# Altium project radxa_cm5_io_board_v2200_SCH-1.PrjPcb (part 1 of 5)
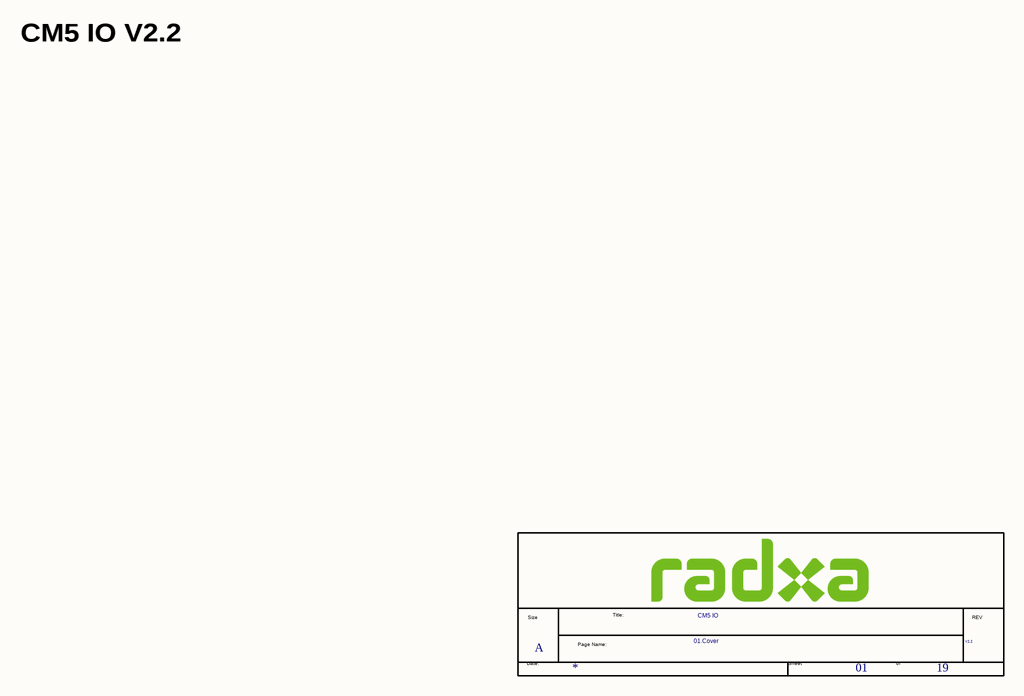
[diagram p0: 01_COVER.SchDoc]
19 sheets, 502 parts. Net scope: global (net labels, ports and power ports of the same name join across sheets).
Sheets:
  01_COVER.SchDoc
  02_INDEX.SchDoc
  03_Block.SchDoc
  04_HDMII_TX.SchDoc
  05_Ethernet.SchDoc
  06_MicroSD_Card.SchDoc
  07_PCIE_WIFI.SchDoc
  08_AUDIO.SchDoc
  09_MIPI_LCD_TX1.SchDoc
  10_MIPI_LCD_TX2.SchDoc
  11_MIPI_CAM_RX.SchDoc
  12_USB_HUB.SchDoc
  13_USB30_USB20.SchDoc
  14_FAN_RTC.SchDoc
  15_Power_DCIN.SchDoc
  16_40PIN_Connector.SchDoc
  17_Connector.SchDoc
  18_Type_C.SchDoc
  19_KEY_LED.SchDoc

## Sheet 01_COVER.SchDoc
size 297 x 209 mm

### Parts
(Parts that share a designator on the sheet are numbered #1, #2 ... from top to bottom, then left to right.)
*#1  Doc: 01.Cover  RevCode: V2.2  Title: CM5 IO  Page Size: A  Page Number: 01  Page Count: 19  (hidden comment: radxa_1010)  (graphical)

### Notes on the sheet
- CM5 IO V2.2
- (in symbol radxa_1010) Size; Title:; REV; Page Name:; Date:; Sheet; of

### Library data of the parts
*#1 = radxa_1010: Page Create Date: March  8, 1995; Page Modify Date: *

## Sheet 02_INDEX.SchDoc
size 297 x 209 mm
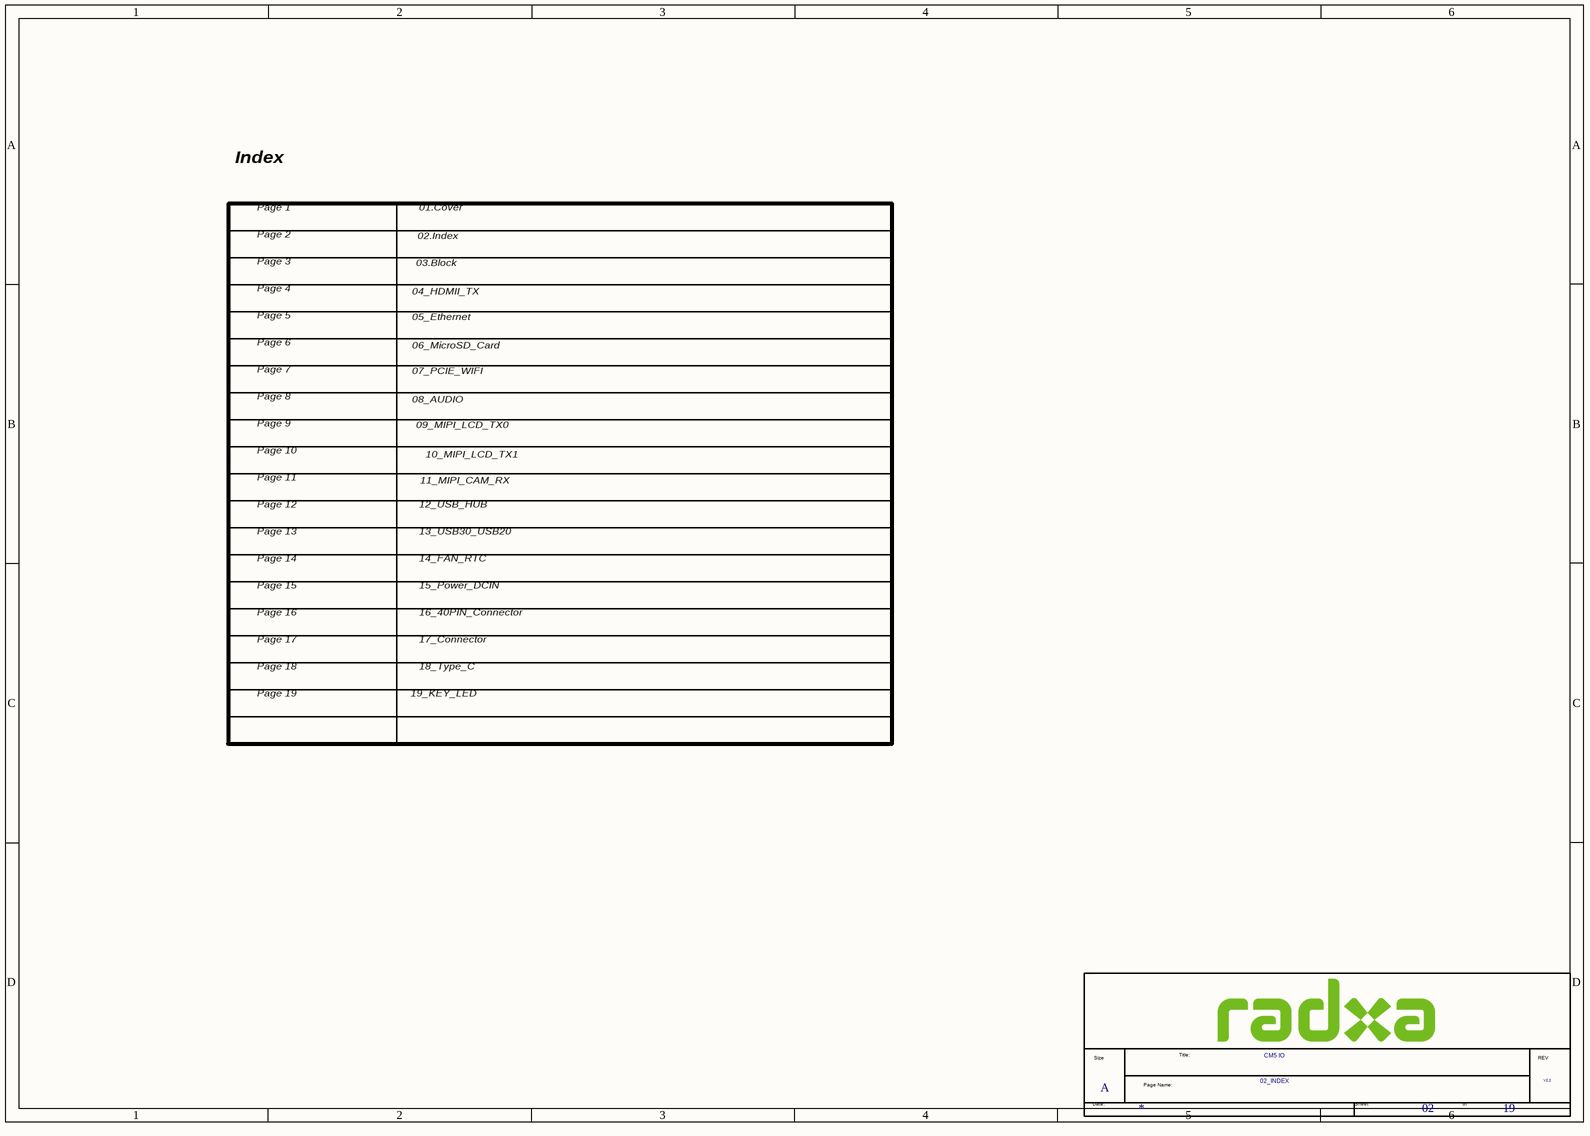
[diagram p1: 02_INDEX.SchDoc]

### Parts
(Parts that share a designator on the sheet are numbered #1, #2 ... from top to bottom, then left to right.)
*#2  Doc: 02_INDEX  RevCode: V2.2  Title: CM5 IO  Page Size: A  Page Number: 02  Page Count: 19  (hidden comment: radxa_1010)  (graphical)

### Notes on the sheet
- Index
- Page 1
- Page 3
- Page 2
- 03.Block
- 02.Index
- 01.Cover
- Page 5
- Page 4
- 05_Ethernet
- 04_HDMII_TX
- Page 8
- Page 6
- Page 7
- 06_MicroSD_Card
- 07_PCIE_WIFI
- 08_AUDIO
- Page 9
- Page 10
- 09_MIPI_LCD_TX0
- 10_MIPI_LCD_TX1
- Page 12
- Page 13
- Page 11
- 12_USB_HUB
- 13_USB30_USB20
- 11_MIPI_CAM_RX
- Page 14
- Page 15
- 15_Power_DCIN
- 14_FAN_RTC
- Page 18
- Page 16
- Page 17
- 16_40PIN_Connector
- 17_Connector
- 18_Type_C
- Page 19
- 19_KEY_LED
- (in symbol radxa_1010) Size; Title:; REV; Page Name:; Date:; Sheet; of

### Library data of the parts
*#2 = radxa_1010: Page Create Date: March  8, 1995; Page Modify Date: *

## Sheet 03_Block.SchDoc
size 459 x 350 mm
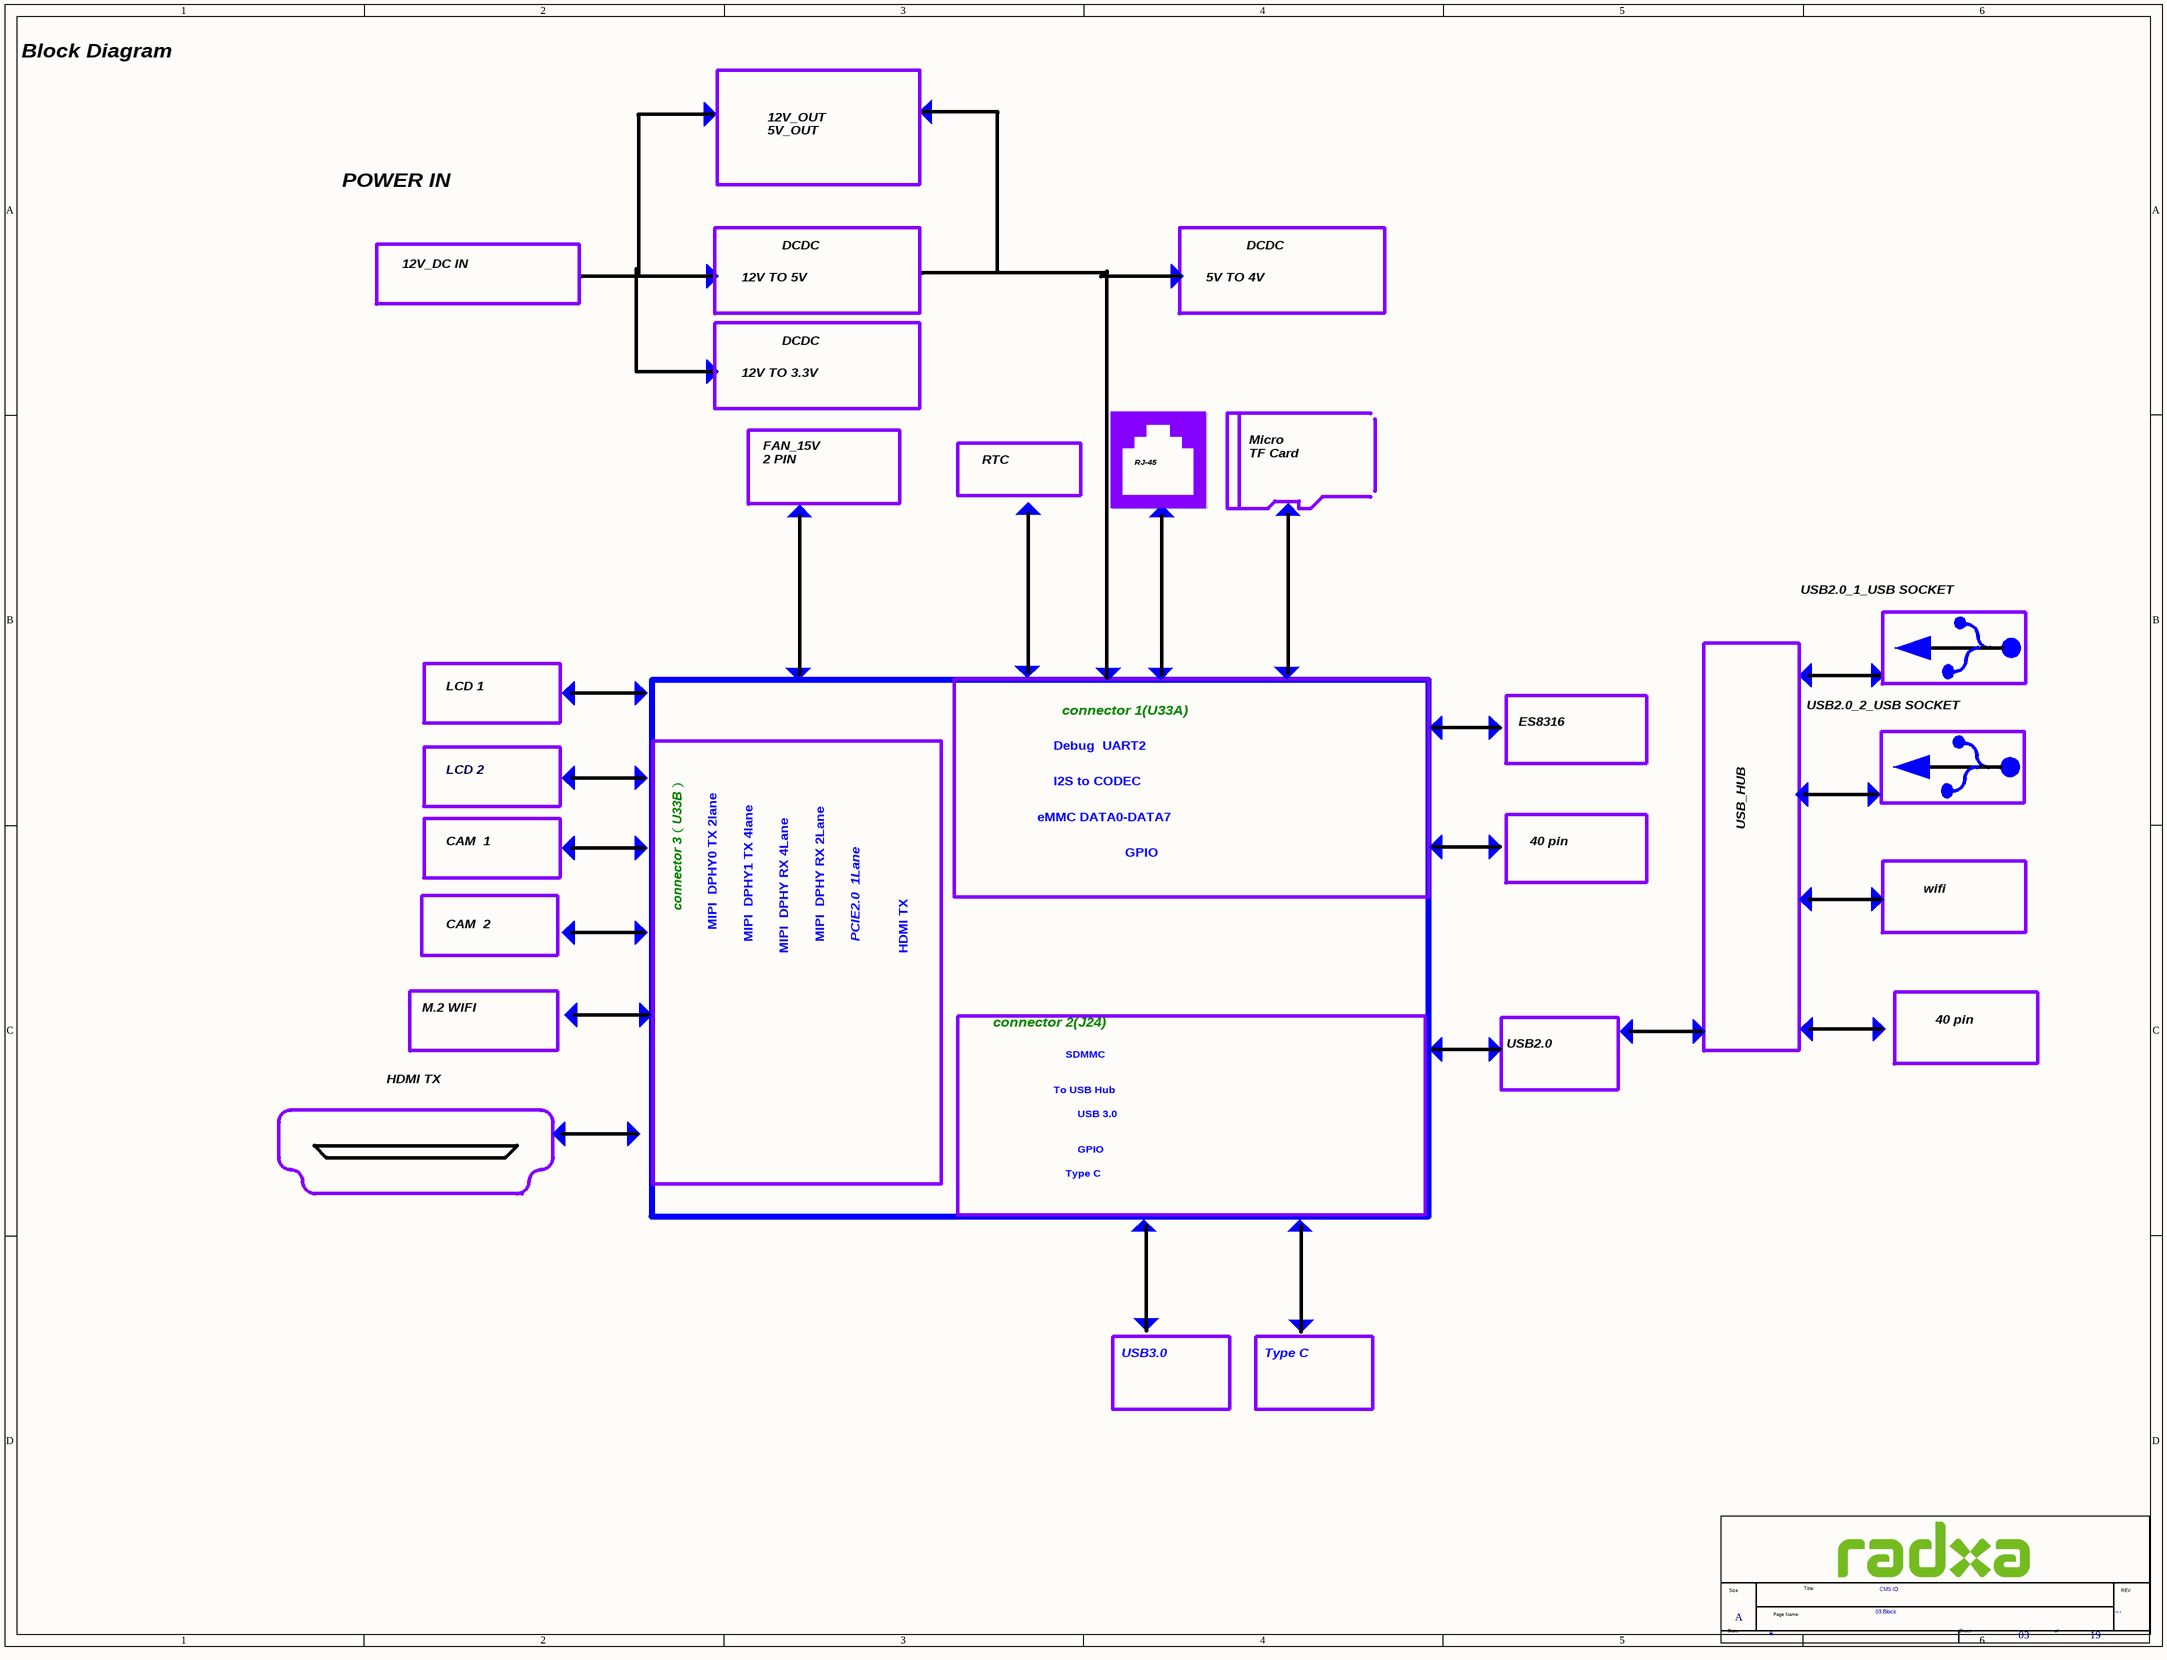
[diagram p2: 03_Block.SchDoc]

### Parts
(Parts that share a designator on the sheet are numbered #1, #2 ... from top to bottom, then left to right.)
*#3  Doc: 03.Block  RevCode: V2.2  Title: CM5 IO  Page Size: A  Page Number: 03  Page Count: 19  (hidden comment: radxa_1010)  (graphical)

### Notes on the sheet
- Block Diagram
- 12V_OUT
  5V_OUT
- POWER IN
- 12V_DC IN
- 12V TO 5V
- DCDC
- 5V TO 4V
- 12V TO 3.3V
- FAN_15V
  2 PIN
- RTC
- RJ-45
- Micro
  TF Card
- USB2.0_1_USB SOCKET
- LCD 1
- connector 1(U33A)
- USB2.0_2_USB SOCKET
- LCD 2
- Debug  UART2
- ES8316
- eMMC DATA0-DATA7
- I2S to CODEC
- USB_HUB
- CAM  1
- GPIO
- 40 pin
- wifi
- CAM  2
- connector 3（U33B）
- MIPI  DPHY0 TX 2lane
- MIPI  DPHY1 TX 4lane
- MIPI  DPHY RX 4Lane
- MIPI  DPHY RX 2Lane
- PCIE2.0  1Lane
- HDMI TX
- M.2 WIFI
- connector 2(J24)
- SDMMC
- USB2.0
- To USB Hub
- USB 3.0
- Type C
- USB3.0
- (in symbol radxa_1010) Size; Title:; REV; Page Name:; Date:; Sheet; of

### Library data of the parts
*#3 = radxa_1010: Page Create Date: March  8, 1995; Page Modify Date: *

## Sheet 04_HDMII_TX.SchDoc
size 297 x 209 mm
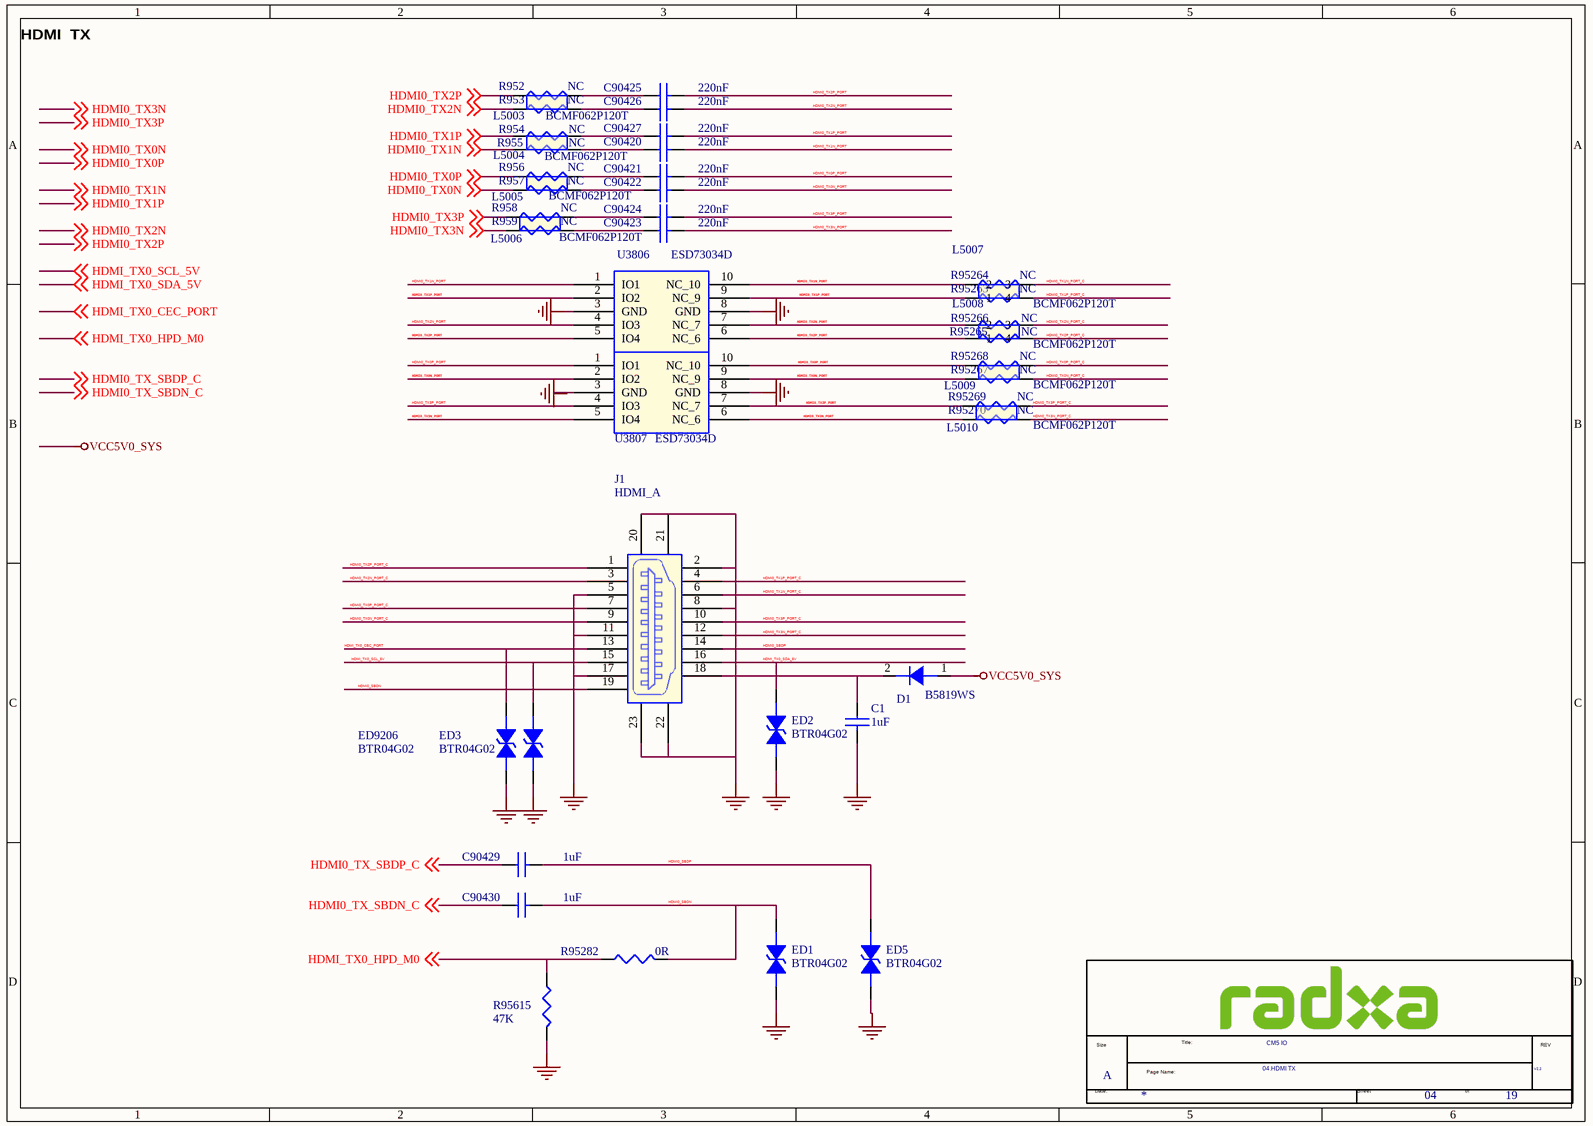
[diagram p3: 04_HDMII_TX.SchDoc]

### Parts
(Parts that share a designator on the sheet are numbered #1, #2 ... from top to bottom, then left to right.)
*#4  Doc: 04.HDMI TX  RevCode: V2.2  Title: CM5 IO  Page Size: A  Page Number: 04  Page Count: 19  (hidden comment: radxa_1010)  (graphical)
C1  1uF  [C0402]
C90420  220nF  [C0201]
C90421  220nF  [C0201]
C90422  220nF  [C0201]
C90423  220nF  [C0201]
C90424  220nF  [C0201]
C90425  220nF  [C0201]
C90426  220nF  [C0201]
C90427  220nF  [C0201]
C90429  1uF  [C0201]
C90430  1uF  [C0201]
D1  B5819WS  [SOD_323]
ED1  BTR04G02  [ESD0402_1xD5]
ED2  BTR04G02  [ESD0402_1xD5]
ED3  BTR04G02  [ESD0402_1xD5]
ED5  BTR04G02  [ESD0402_1xD5]
ED9206  BTR04G02  [ESD0402_1xD5]
J1  HDMI_A  [HDMIA19S]
L5003  BCMF062P120T  [MCZ1210AH900L2]
L5004  BCMF062P120T  [MCZ1210AH900L2]
L5005  BCMF062P120T  [MCZ1210AH900L2]
L5006  BCMF062P120T  [MCZ1210AH900L2]
L5007  BCMF062P120T  [MCZ1210AH900L2]
L5008  BCMF062P120T  [MCZ1210AH900L2]
L5009  BCMF062P120T  [MCZ1210AH900L2]
L5010  BCMF062P120T  [MCZ1210AH900L2]
R952  NC  [R0402]
R953  NC  [R0402]
R954  NC  [R0402]
R955  NC  [R0402]
R956  NC  [R0402]
R957  NC  [R0402]
R958  NC  [R0402]
R959  NC  [R0402]
R95263  NC  [R0402]
R95264  NC  [R0402]
R95265  NC  [R0402]
R95266  NC  [R0402]
R95267  NC  [R0402]
R95268  NC  [R0402]
R95269  NC  [R0402]
R95270  NC  [R0402]
R95282  0R  [R0402]
R95615  47K  [R0402]
U3806  ESD73034D  [SON10_2R50X1R00X0R50]
U3807  ESD73034D  [SON10_2R50X1R00X0R50]

### Nets
GND: C1.2 ED1.2 ED2.2 ED3.2 ED5.2 ED9206.2 J1.2 J1.5 J1.8 J1.11 J1.17 J1.20 J1.21 J1.22 J1.23 R95615.2 U3806.3(GND) U3806.8(GND) U3807.8(GND)
VCC5V0_SYS: D1.1(A)
HDMI0_SBDN: C90430.2 ED1.1 J1.19 R95282.2
HDMI0_SBDP: C90429.2 ED5.1 J1.14
HDMI0_TX0N: L5005.2 R957.1 ; off-sheet HDMI0_TX0N
HDMI0_TX0N_PORT: C90422.2 L5009.2 R95267.1 U3807.2(IO2) U3807.9(NC_9)
HDMI0_TX0N_PORT_C: J1.9 L5009.3 R95267.2
HDMI0_TX0P: L5005.1 R956.1 ; off-sheet HDMI0_TX0P
HDMI0_TX0P_PORT: C90421.2 L5009.1 R95268.1 U3807.1(IO1) U3807.10(NC_10)
HDMI0_TX0P_PORT_C: J1.7 L5009.4 R95268.2
HDMI0_TX1N: L5004.2 R955.1 ; off-sheet HDMI0_TX1N
HDMI0_TX1N_PORT: C90420.2 L5007.2 R95264.1 U3806.1(IO1) U3806.10(NC_10)
HDMI0_TX1N_PORT_C: J1.6 L5007.3 R95264.2
HDMI0_TX1P: L5004.1 R954.1 ; off-sheet HDMI0_TX1P
HDMI0_TX1P_PORT: C90427.2 L5007.1 R95263.1 U3806.2(IO2) U3806.9(NC_9)
HDMI0_TX1P_PORT_C: J1.4 L5007.4 R95263.2
HDMI0_TX2N: L5003.2 R953.1 ; off-sheet HDMI0_TX2N
HDMI0_TX2N_PORT: C90426.2 L5008.2 R95266.1 U3806.4(IO3) U3806.7(NC_7)
HDMI0_TX2N_PORT_C: J1.3 L5008.3 R95266.2
HDMI0_TX2P: L5003.1 R952.1 ; off-sheet HDMI0_TX2P
HDMI0_TX2P_PORT: C90425.2 L5008.1 R95265.1 U3806.5(IO4) U3806.6(NC_6)
HDMI0_TX2P_PORT_C: J1.1($PIN0) L5008.4 R95265.2
HDMI0_TX3N: L5006.2 R959.1 ; off-sheet HDMI0_TX3N
HDMI0_TX3N_PORT: C90423.2 L5010.2 R95270.1 U3807.5(IO4) U3807.6(NC_6)
HDMI0_TX3N_PORT_C: J1.12 L5010.3 R95270.2
HDMI0_TX3P: L5006.1 R958.1 ; off-sheet HDMI0_TX3P
HDMI0_TX3P_PORT: C90424.2 L5010.1 R95269.1 U3807.4(IO3) U3807.7(NC_7)
HDMI0_TX3P_PORT_C: J1.10 L5010.4 R95269.2
HDMI0_TX_SBDN_C: C90430.1 ; off-sheet HDMI0_TX_SBDN_C
HDMI0_TX_SBDP_C: C90429.1 ; off-sheet HDMI0_TX_SBDP_C
HDMI_TX0_CEC_PORT: ED9206.1 J1.13 ; off-sheet HDMI_TX0_CEC_PORT
HDMI_TX0_HPD_M0: R95282.1 R95615.1 ; off-sheet HDMI_TX0_HPD_M0
HDMI_TX0_SCL_5V: ED3.1 J1.15 ; off-sheet HDMI_TX0_SCL_5V
HDMI_TX0_SDA_5V: ED2.1 J1.16 ; off-sheet HDMI_TX0_SDA_5V
NetC1_1: C1.1 D1.2(K) J1.18
NetC90420_1: C90420.1 L5004.3 R955.2
NetC90421_1: C90421.1 L5005.4 R956.2
NetC90422_1: C90422.1 L5005.3 R957.2
NetC90423_1: C90423.1 L5006.3 R959.2
NetC90424_1: C90424.1 L5006.4 R958.2
NetC90425_1: C90425.1 L5003.4 R952.2
NetC90426_1: C90426.1 L5003.3 R953.2
NetC90427_1: C90427.1 L5004.4 R954.2

Not connected (* = marked no-connect by the designer): U3807 3(GND)

### Notes on the sheet
- HDMI  TX
- Labels drawn without touching a wire or pin: GND
- (in symbol radxa_1010) Size; Title:; REV; Page Name:; Date:; Sheet; of

### Library data of the parts
C1 = CAP NP_0: cap,1.00uF,+/-10%,10V,X5R,C0402; Manufacturer: TDK; RK PN: C1005X5R1A105K050BB; Priority: A; Tolerance: 10%; Voltage: 10V; PCB Footprint: C0402; Dielectric: X5R; Part Type: C0402; Manufacturer PN: C1005X5R1A105K050BB; Created by: JJJ
C90420-C90424 C90427 = CAP NP_0_Dup5: cap,220.00nF,+/-10%,10V,X5R,C0201; Manufacturer: TDK; RK PN: C0603X5R1A224K030BB; Priority: A; Tolerance: 10%; Voltage: 10V; PCB Footprint: C0201; Dielectric: X5R; Part Type: C0201; Manufacturer PN: C0603X5R1A224K030BB; Created by: JJJ
C90425 C90426 = CAP NP_0_Dup5: cap,220.00nF,+/-10%,10V,X5R,C0201; Manufacturer PN: C0603X5R1A224K030BB; Manufacturer: TDK; Tolerance: 10%; Priority: A; Voltage: 10V; PCB Footprint: C0201; Dielectric: X5R; Created by: JJJ; Part Type: C0201; RK PN: C0603X5R1A224K030BB
C90429 C90430 = CAP NP_0_Dup5: cap,1.00uF,+/-10%,10V,X5R,C0402; Manufacturer PN: C1005X5R1A105K050BB; Manufacturer: TDK; Tolerance: 10%; Priority: A; Voltage: 10V; PCB Footprint: C0201; Dielectric: X5R; Created by: JJJ; Part Type: C0402; RK PN: C1005X5R1A105K050BB
D1 = DIODE_Dup1: Schottky Barrier，B5819WS SOD-323; Manufacturer: 长电; Priority: A; PCB Footprint: SOD_323; Created by: JJJ; Manufacturer PN: B5819WS; Part Type: Schottky rectifier; RK PN: B5819WS
ED1 ED2 = DIODE BI_DIR TRIG_2: 1-Line, Bi-directional, Transient Voltage Suppressors.17.5pF.; Manufacturer PN: ESD5451N; Manufacturer: WillSemi(韦尔半导体); Priority: A; PCB Footprint: ESD0402_1xD5; Created by: JJJ; Part Type: ESD_TVS; RK PN: ESD5451N
ED3 ED5 ED9206 = DIODE BI_DIR TRIG_2: 1-Line, Bi-directional, Transient Voltage Suppressors.17.5pF.; Manufacturer: WillSemi(韦尔半导体); RK PN: ESD5451N; Priority: A; PCB Footprint: ESD0402_1xD5; Part Type: ESD_TVS; Manufacturer PN: ESD5451N; Created by: JJJ
J1 = HDMI_A: 通用A型HDMI座,卧式,侧插; Manufacturer: 旺科达; Priority: A; PCB Footprint: HDMIA19S; Created by: JJJ; Manufacturer Part Number: HDMI_A; Part Type: HDMI Jack; RK PN: HDMI_A
L5003-L5006 L5009 L5010 = MCZ1210AH900L2_2: PCB Footprint: SMD_TCM0605T
L5007 = MCZ1210AH900L2_0: PCB Footprint: SMD_TCM0605T
L5008 = MCZ1210AH900L2_1: PCB Footprint: SMD_TCM0605T
R952-R959 R95264 = RESISTOR_1_Dup1: 通用厚膜电阻,1K2,+/-5%,R0402,1/16W.; Manufacturer PN: RC0402JR-071K2L; Manufacturer: YAGEO; PCB Footprint: r0201; Tolerance: 5%; Wattage: 1/16W; Priority: A; Created by: YTL; Part Type: 通用厚膜电阻; RK PN: RC0402JR-071K2L
R95263 R95265-R95270 = RESISTOR_1_Dup1: 通用厚膜电阻,1K2,+/-5%,R0402,1/16W.; Manufacturer: YAGEO; PCB Footprint: r0201; Tolerance: 5%; RK PN: RC0402JR-071K2L; Priority: A; Wattage: 1/16W; Part Type: 通用厚膜电阻; Manufacturer PN: RC0402JR-071K2L; Created by: YTL
R95282 = RESISTOR_0_Dup2: 通用厚膜电阻,1K2,+/-5%,R0402,1/16W.; Manufacturer: YAGEO; Tolerance: 5%; RK PN: RC0402JR-071K2L; Priority: A; Wattage: 1/16W; PCB Footprint: R0402; Part Type: 通用厚膜电阻; Manufacturer PN: RC0402JR-071K2L; Created by: YTL
R95615 = RESISTOR_0_Dup4: 通用厚膜电阻,2K49,+/-1%,R0402,1/16W.; Manufacturer PN: RC0402FR-072K49L; Manufacturer: YAGEO; Tolerance: 1%; Wattage: 1/16W; Priority: A; PCB Footprint: R0402; Created by: YTL; Part Type: 通用厚膜电阻; RK PN: RC0402FR-072K49L
U3806 U3807 = ESD_ESD73034D: 4-Lines, Bi-directional, Ultra-low Capacitance Transient Voltage Suppressors; Manufacturer: WillSemi(韦尔半导体); Priority: A; PCB Footprint: SON10_2R50X1R00X0R50; RK PN: ESD73034D; Part Type: ESD_TVS; Manufacturer PN: ESD73034D; Created by: YWQ
*#4 = radxa_1010: Page Create Date: March  8, 1995; Page Modify Date: *

## Sheet 05_Ethernet.SchDoc
size 297 x 209 mm
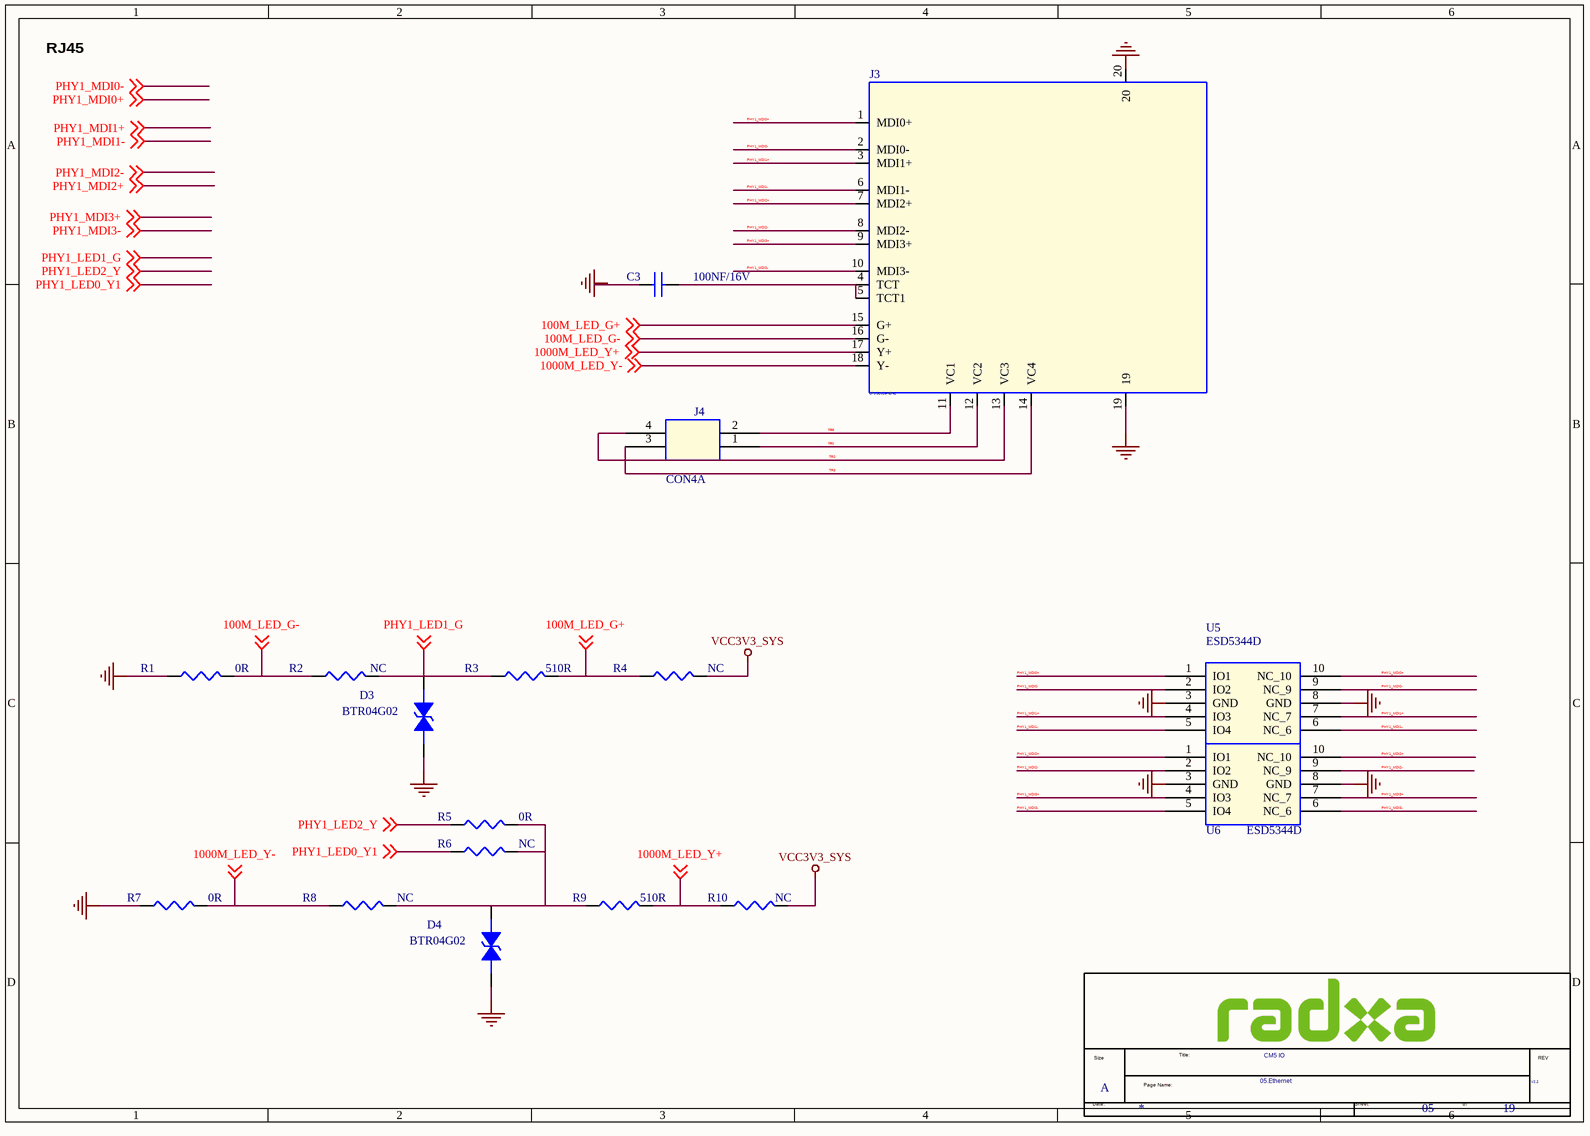
[diagram p4: 05_Ethernet.SchDoc]

### Parts
(Parts that share a designator on the sheet are numbered #1, #2 ... from top to bottom, then left to right.)
*#5  Doc: 05.Ethernet  RevCode: V2.2  Title: CM5 IO  Page Size: A  Page Number: 05  Page Count: 19  (hidden comment: radxa_1010)  (graphical)
C3  100NF/16V  [C0402]
D3  BTR04G02  [ESD0402_1xD5]
D4  BTR04G02  [ESD0402_1xD5]
J3  LPJG0926HENL  [RJ45_PULSE]
J4  CON4A  [DIP4PIN-2_54MM-2X2]
R1  0R  [R0402]
R2  NC  [R0402]
R3  510R  [R0402]
R4  NC  [R0402]
R5  0R  [R0402]
R6  NC  [R0402]
R7  0R  [R0402]
R8  NC  [R0402]
R9  510R  [R0402]
R10  NC  [R0402]
U5  ESD5344D  [SON10_2R50X1R00X0R50]
U6  ESD5344D  [SON10_2R50X1R00X0R50]

### Nets
GND: D3.1 D4.1 J3.19 J3.20 R1.1 R7.1 U5.3(GND) U5.8(GND) U6.3(GND) U6.8(GND)
VCC3V3_SYS: R4.2 R10.2
100M_LED_G+: J3.15(G+) R3.2 R4.1 ; off-sheet 100M_LED_G+
100M_LED_G-: J3.16(G-) R1.2 R2.1 ; off-sheet 100M_LED_G-
1000M_LED_Y+: J3.17(Y+) R9.2 R10.1 ; off-sheet 1000M_LED_Y+
1000M_LED_Y-: J3.18(Y-) R7.2 R8.1 ; off-sheet 1000M_LED_Y-
PHY1_LED0_Y1: R6.1 ; off-sheet PHY1_LED0_Y1
PHY1_LED1_G: D3.2 R2.2 R3.1 ; off-sheet PHY1_LED1_G
PHY1_LED2_Y: R5.1 ; off-sheet PHY1_LED2_Y
PHY1_MDI0+: J3.1(MDI0+) U5.1(IO1) U5.10(NC_10) ; off-sheet PHY1_MDI0+
PHY1_MDI0-: J3.2(MDI0-) U5.2(IO2) U5.9(NC_9) ; off-sheet PHY1_MDI0-
PHY1_MDI1+: J3.3(MDI1+) U5.4(IO3) U5.7(NC_7) ; off-sheet PHY1_MDI1+
PHY1_MDI1-: J3.6(MDI1-) U5.5(IO4) U5.6(NC_6) ; off-sheet PHY1_MDI1-
PHY1_MDI2+: J3.7(MDI2+) U6.1(IO1) U6.10(NC_10) ; off-sheet PHY1_MDI2+
PHY1_MDI2-: J3.8(MDI2-) U6.2(IO2) U6.9(NC_9) ; off-sheet PHY1_MDI2-
PHY1_MDI3+: J3.9(MDI3+) U6.4(IO3) U6.7(NC_7) ; off-sheet PHY1_MDI3+
PHY1_MDI3-: J3.10(MDI3-) U6.5(IO4) U6.6(NC_6) ; off-sheet PHY1_MDI3-
TR0: J3.11(VC1) J4.2
TR1: J3.12(VC2) J4.1
TR2: J3.13(VC3) J4.4
TR3: J3.14(VC4) J4.3
NetC3_2: C3.2 J3.4(TCT) J3.5(TCT1)
NetD4_2: D4.2 R5.2 R6.2 R8.2 R9.1

Not connected (* = marked no-connect by the designer): C3 1

### Notes on the sheet
- RJ45
- Labels drawn without touching a wire or pin: GND
- (in symbol radxa_1010) Size; Title:; REV; Page Name:; Date:; Sheet; of

### Library data of the parts
C3 = CAP NP_0: cap,100.00nF,+/-10%,16V,X5R,C0402; Manufacturer: TDK; RK PN: C1005X5R1C104K050BA; Priority: A; Tolerance: 10%; Voltage: 16V; PCB Footprint: C0402; Dielectric: X5R; Part Type: C0402; Manufacturer PN: C1005X5R1C104K050BA; Created by: JJJ
D3 = DIODE BI_DIR TRIG_2: 1-Line, Bi-directional, Transient Voltage Suppressors.17.5pF.; Manufacturer PN: ESD5451N; Manufacturer: WillSemi(韦尔半导体); OPTION: DNP; Priority: A; PCB Footprint: ESD0402_1xD5; Created by: JJJ; Part Type: ESD_TVS; RK PN: ESD5451N
D4 = DIODE BI_DIR TRIG_2: 1-Line, Bi-directional, Transient Voltage Suppressors.17.5pF.; Manufacturer: WillSemi(韦尔半导体); RK PN: ESD5451N; Priority: A; OPTION: DNP; PCB Footprint: ESD0402_1xD5; Part Type: ESD_TVS; Manufacturer PN: ESD5451N; Created by: JJJ
J3 = HR911130C_1: 千兆网口接口，内置变压器; VAL: J00-0061; DESIG: 10/100 base TX LXT971A; BOI: RJ45; FAB: PULSE; DEV: CON_PULSE_J00-61; Priority: A; PCB Footprint: RJ45_HRK1; REF: J00-0061; Created by: JJJ; Manufacturer Part Number: HR911130C; Part Type: Ethernet Jack; RK PN: HR911130C
J4 = CON4A_0: PCB Footprint: DIP4PIN-2_54MM-2X2
R1 R2 R6 = RESISTOR_0_Dup3: 通用厚膜电阻,0R,+/-5%,R0402,1/16W.; Manufacturer PN: RC0402JR-070RL; Manufacturer: YAGEO; Tolerance: 5%; Wattage: 1/16W; Priority: A; PCB Footprint: R0402; Created by: YTL; Part Type: 通用厚膜电阻; RK PN: RC0402JR-070RL
R3 R9 = RESISTOR_0_Dup3: 通用厚膜电阻,0R,+/-5%,R0402,1/16W.; Manufacturer: YAGEO; Tolerance: 5%; RK PN: RC0402JR-070RL; Priority: A; Wattage: 1/16W; option: DNP; PCB Footprint: R0402; Part Type: 通用厚膜电阻; Manufacturer PN: RC0402JR-070RL; Created by: YTL
R4 = RESISTOR_0_Dup3: 通用厚膜电阻,510R,+/-5%,R0402,1/16W.; Manufacturer PN: RC0402JR-07510RL; Manufacturer: YAGEO; Tolerance: 5%; Wattage: 1/16W; Priority: A; PCB Footprint: R0402; Created by: YTL; Part Type: 通用厚膜电阻; RK PN: RC0402JR-07510RL
R5 R7 R8 = RESISTOR_0_Dup3: 通用厚膜电阻,0R,+/-5%,R0402,1/16W.; Manufacturer: YAGEO; Tolerance: 5%; RK PN: RC0402JR-070RL; Priority: A; Wattage: 1/16W; PCB Footprint: R0402; Part Type: 通用厚膜电阻; Manufacturer PN: RC0402JR-070RL; Created by: YTL
R10 = RESISTOR_0_Dup3: 通用厚膜电阻,510R,+/-5%,R0402,1/16W.; Manufacturer: YAGEO; Tolerance: 5%; RK PN: RC0402JR-07510RL; Priority: A; Wattage: 1/16W; PCB Footprint: R0402; Part Type: 通用厚膜电阻; Manufacturer PN: RC0402JR-07510RL; Created by: YTL
U5 U6 = ESD_ESD5304D: 4-Lines, Uni-directional, Ultra-low Capacitance Transient Voltage Suppressors; Manufacturer: WillSemi(韦尔半导体); Priority: A; PCB Footprint: SON10_2R50X1R00X0R50; Created by: JJJ; Manufacturer PN: ESD5304D; Part Type: ESD_TVS; RK PN: ESD5304D
*#5 = radxa_1010: Page Create Date: March  8, 1995; Page Modify Date: *

## Sheet 06_MicroSD_Card.SchDoc
size 297 x 209 mm
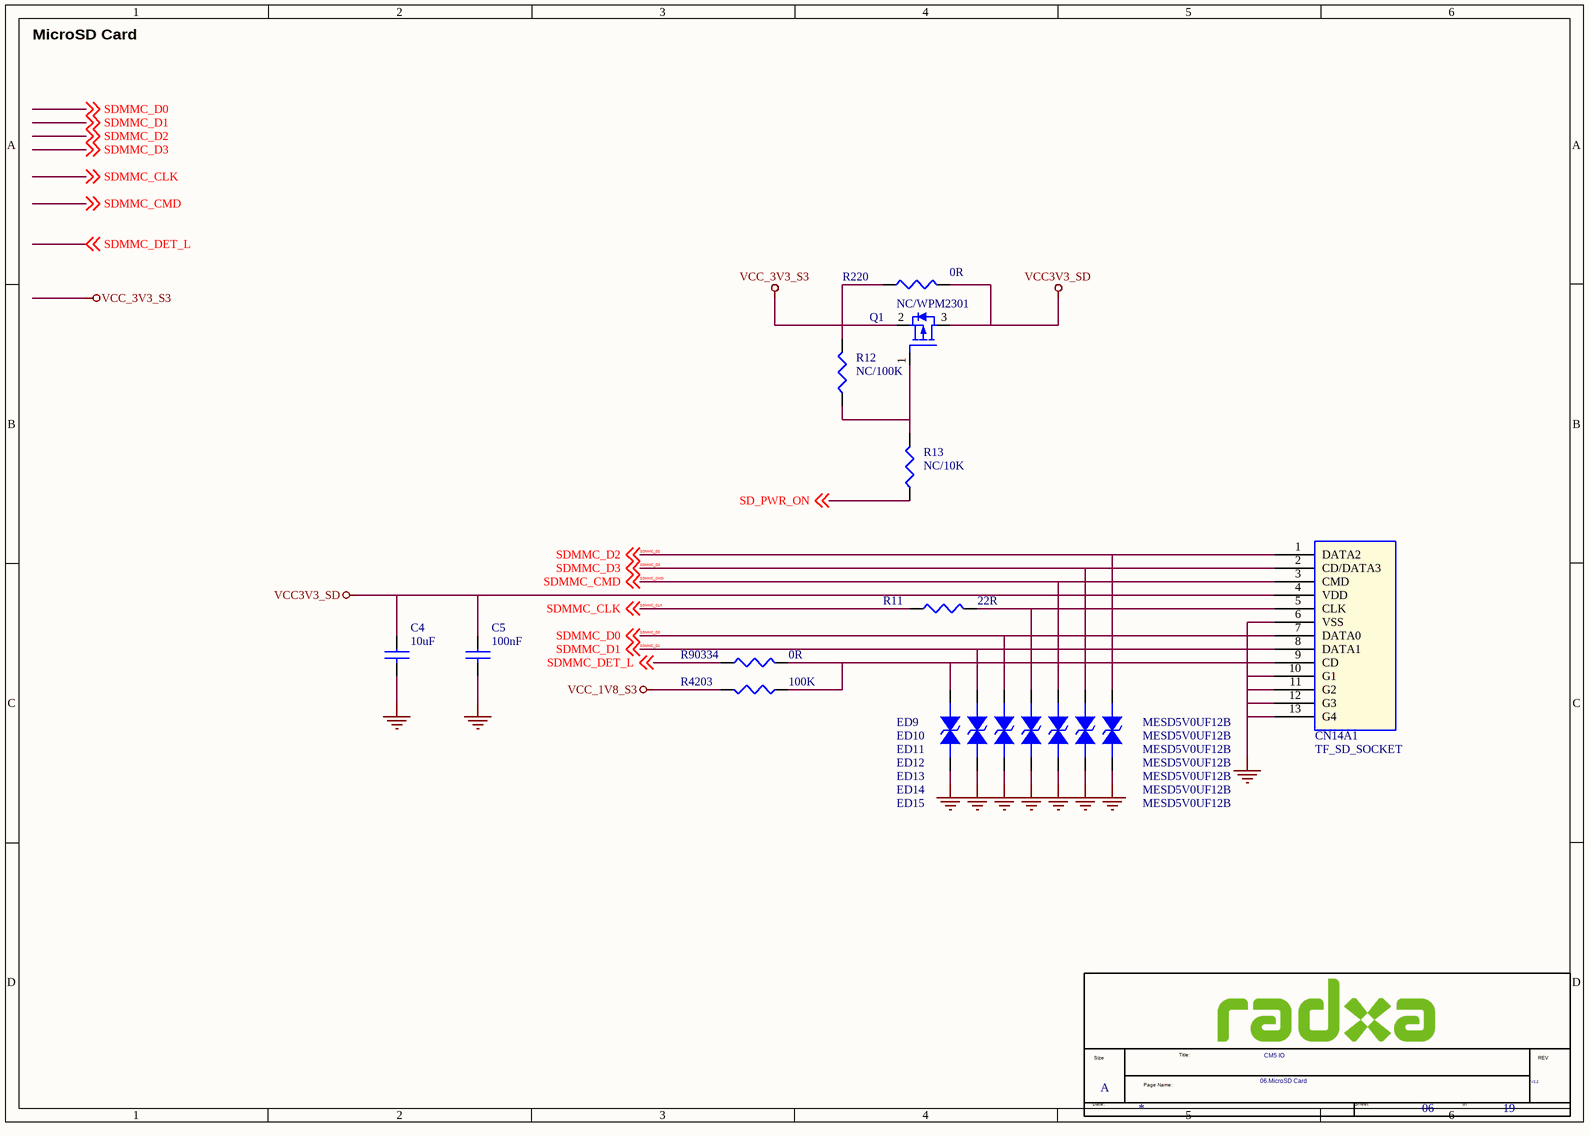
[diagram p5: 06_MicroSD_Card.SchDoc]

### Parts
(Parts that share a designator on the sheet are numbered #1, #2 ... from top to bottom, then left to right.)
*#6  Doc: 06.MicroSD Card  RevCode: V2.2  Title: CM5 IO  Page Size: A  Page Number: 06  Page Count: 19  (hidden comment: radxa_1010)  (graphical)
C4  10uF  [C0603]
C5  100nF  [C0402]
CN14A1  TF_SD_SOCKET  [TF-CKT01-009D]
ED9  MESD5V0UF12B  [E0402N]
ED10  MESD5V0UF12B  [E0402N]
ED11  MESD5V0UF12B  [E0402N]
ED12  MESD5V0UF12B  [E0402N]
ED13  MESD5V0UF12B  [E0402N]
ED14  MESD5V0UF12B  [E0402N]
ED15  MESD5V0UF12B  [E0402N]
Q1  NC/WPM2301  [SOT23]
R11  22R  [R0402]
R12  NC/100K  [R0402]
R13  NC/10K  [R0402]
R220  0R  [R0402]
R4203  100K  [R0402]
R90334  0R  [R0402]

### Nets
GND: C4.2 C5.2 CN14A1.6(VSS) CN14A1.10(G1) CN14A1.11(G2) CN14A1.12(G3) CN14A1.13(G4) ED9.2 ED10.2 ED11.2 ED12.2 ED13.2 ED14.2 ED15.2
VCC3V3_SD: C4.1 C5.1 CN14A1.4(VDD) Q1.3(DRAIN) R220.2
VCC_1V8_S3: R4203.2
VCC_3V3_S3: Q1.2(SOURCE) R12.1 R220.1
SD_PWR_ON: R13.2 ; off-sheet SD_PWR_ON
SDMMC_CLK: R11.1 ; off-sheet SDMMC_CLK
SDMMC_CMD: CN14A1.3(CMD) ED13.1 ; off-sheet SDMMC_CMD
SDMMC_D0: CN14A1.7(DATA0) ED11.1 ; off-sheet SDMMC_D0
SDMMC_D1: CN14A1.8(DATA1) ED10.1 ; off-sheet SDMMC_D1
SDMMC_D2: CN14A1.1(DATA2) ED15.1 ; off-sheet SDMMC_D2
SDMMC_D3: CN14A1.2(CD/DATA3) ED14.1 ; off-sheet SDMMC_D3
SDMMC_DET_L: R90334.1 ; off-sheet SDMMC_DET_L
NetCN14A1_5: CN14A1.5(CLK) ED12.1 R11.2
NetCN14A1_9: CN14A1.9(CD) ED9.1 R4203.1 R90334.2
NetQ1_1: Q1.1(GATE) R12.2 R13.1

### Notes on the sheet
- MicroSD Card
- (in symbol radxa_1010) Size; Title:; REV; Page Name:; Date:; Sheet; of

### Library data of the parts
C4 = CAP NP_0: cap,10.00uF,+/-10%,10V,X5R,C0603; Manufacturer PN: C1608X5R1A106K080AC; Manufacturer: TDK; Tolerance: 10%; C_Voltage: 6.3V; Priority: A; Voltage: 10V; PCB Footprint: C0603; Dielectric: X5R; Created by: JJJ; Part Type: C0603; RK PN: C1608X5R1A106K080AC
C5 = CAP NP_0: cap,100.00nF,+/-10%,10V,X5R,C0402; Manufacturer PN: C1005X5R1A104K050BA; Manufacturer: TDK; C_Voltage: 6.3V; Tolerance: 10%; Priority: A; Voltage: 10V; PCB Footprint: C0402; Dielectric: X5R; Created by: JJJ; Part Type: C0402; RK PN: C1005X5R1A104K050BA
CN14A1 = SD_SOCKET_0: PCB Footprint: TF-CKT01-009D
ED9-ED15 = DIODE BI-DIR TRIG: ESD; PCB Footprint: E0402N
Q1 = MOSFET P: PMOS,WPM3407-3/TR,SOT_23,Id=4.4A,Vds=30V; Manufacturer: WillSemi(韦尔半导体); Pd: 0.9W; Vgsth: 2.0V; VDS: 30V; Vgs: ±20V; Id_max: 4.4A; Priority: A; PCB Footprint: SOT23; Created by: JJJ; Manufacturer PN: WPM3407-3/TR; Part Type: PMOS; RK PN: WPM3407-3/TR
R11 = RESISTOR_1_Dup2: PCB Footprint: R0402
R12 = RESISTOR_0_Dup3: 通用厚膜电阻,100K,+/-5%,R0402,1/16W.; Manufacturer: YAGEO; Tolerance: 5%; RK PN: RC0402JR-07100KL; Priority: A; Wattage: 1/16W; PCB Footprint: R0402; Part Type: 通用厚膜电阻; Manufacturer PN: RC0402JR-07100KL; Created by: YTL
R13 = RESISTOR_0_Dup3: 通用厚膜电阻,10K,+/-5%,R0402,1/16W.; Manufacturer PN: RC0402JR-0710KL; Manufacturer: YAGEO; Tolerance: 5%; Wattage: 1/16W; Priority: A; PCB Footprint: R0402; Created by: YTL; Part Type: 通用厚膜电阻; RK PN: RC0402JR-0710KL
R220 = RESISTOR_0_Dup3: 通用厚膜电阻,0R,+/-5%,R0402,1/16W.; Manufacturer: YAGEO; Tolerance: 5%; PCB Footprint: R0603; RK PN: RC0402JR-070RL; Priority: A; Wattage: 1/16W; Part Type: 通用厚膜电阻; Manufacturer PN: RC0402JR-070RL; Created by: YTL
R4203 = RESISTOR_1: 通用厚膜电阻,100K,+/-5%,R0402,1/16W.; Manufacturer PN: RC0402JR-07100KL; Manufacturer: YAGEO; Tolerance: 5%; Wattage: 1/16W; Priority: A; PCB Footprint: R0402; Created by: YTL; Part Type: 通用厚膜电阻; RK PN: RC0402JR-07100KL
R90334 = RESISTOR_0_Dup2: 通用厚膜电阻,0R,+/-5%,R0402,1/16W.; Manufacturer PN: RC0402JR-070RL; Manufacturer: YAGEO; Tolerance: 5%; Wattage: 1/16W; Priority: A; PCB Footprint: R0402; Created by: YTL; Part Type: 通用厚膜电阻; RK PN: RC0402JR-070RL
*#6 = radxa_1010: Page Create Date: March  8, 1995; Page Modify Date: *

## Sheet 07_PCIE_WIFI.SchDoc
size 386 x 246 mm
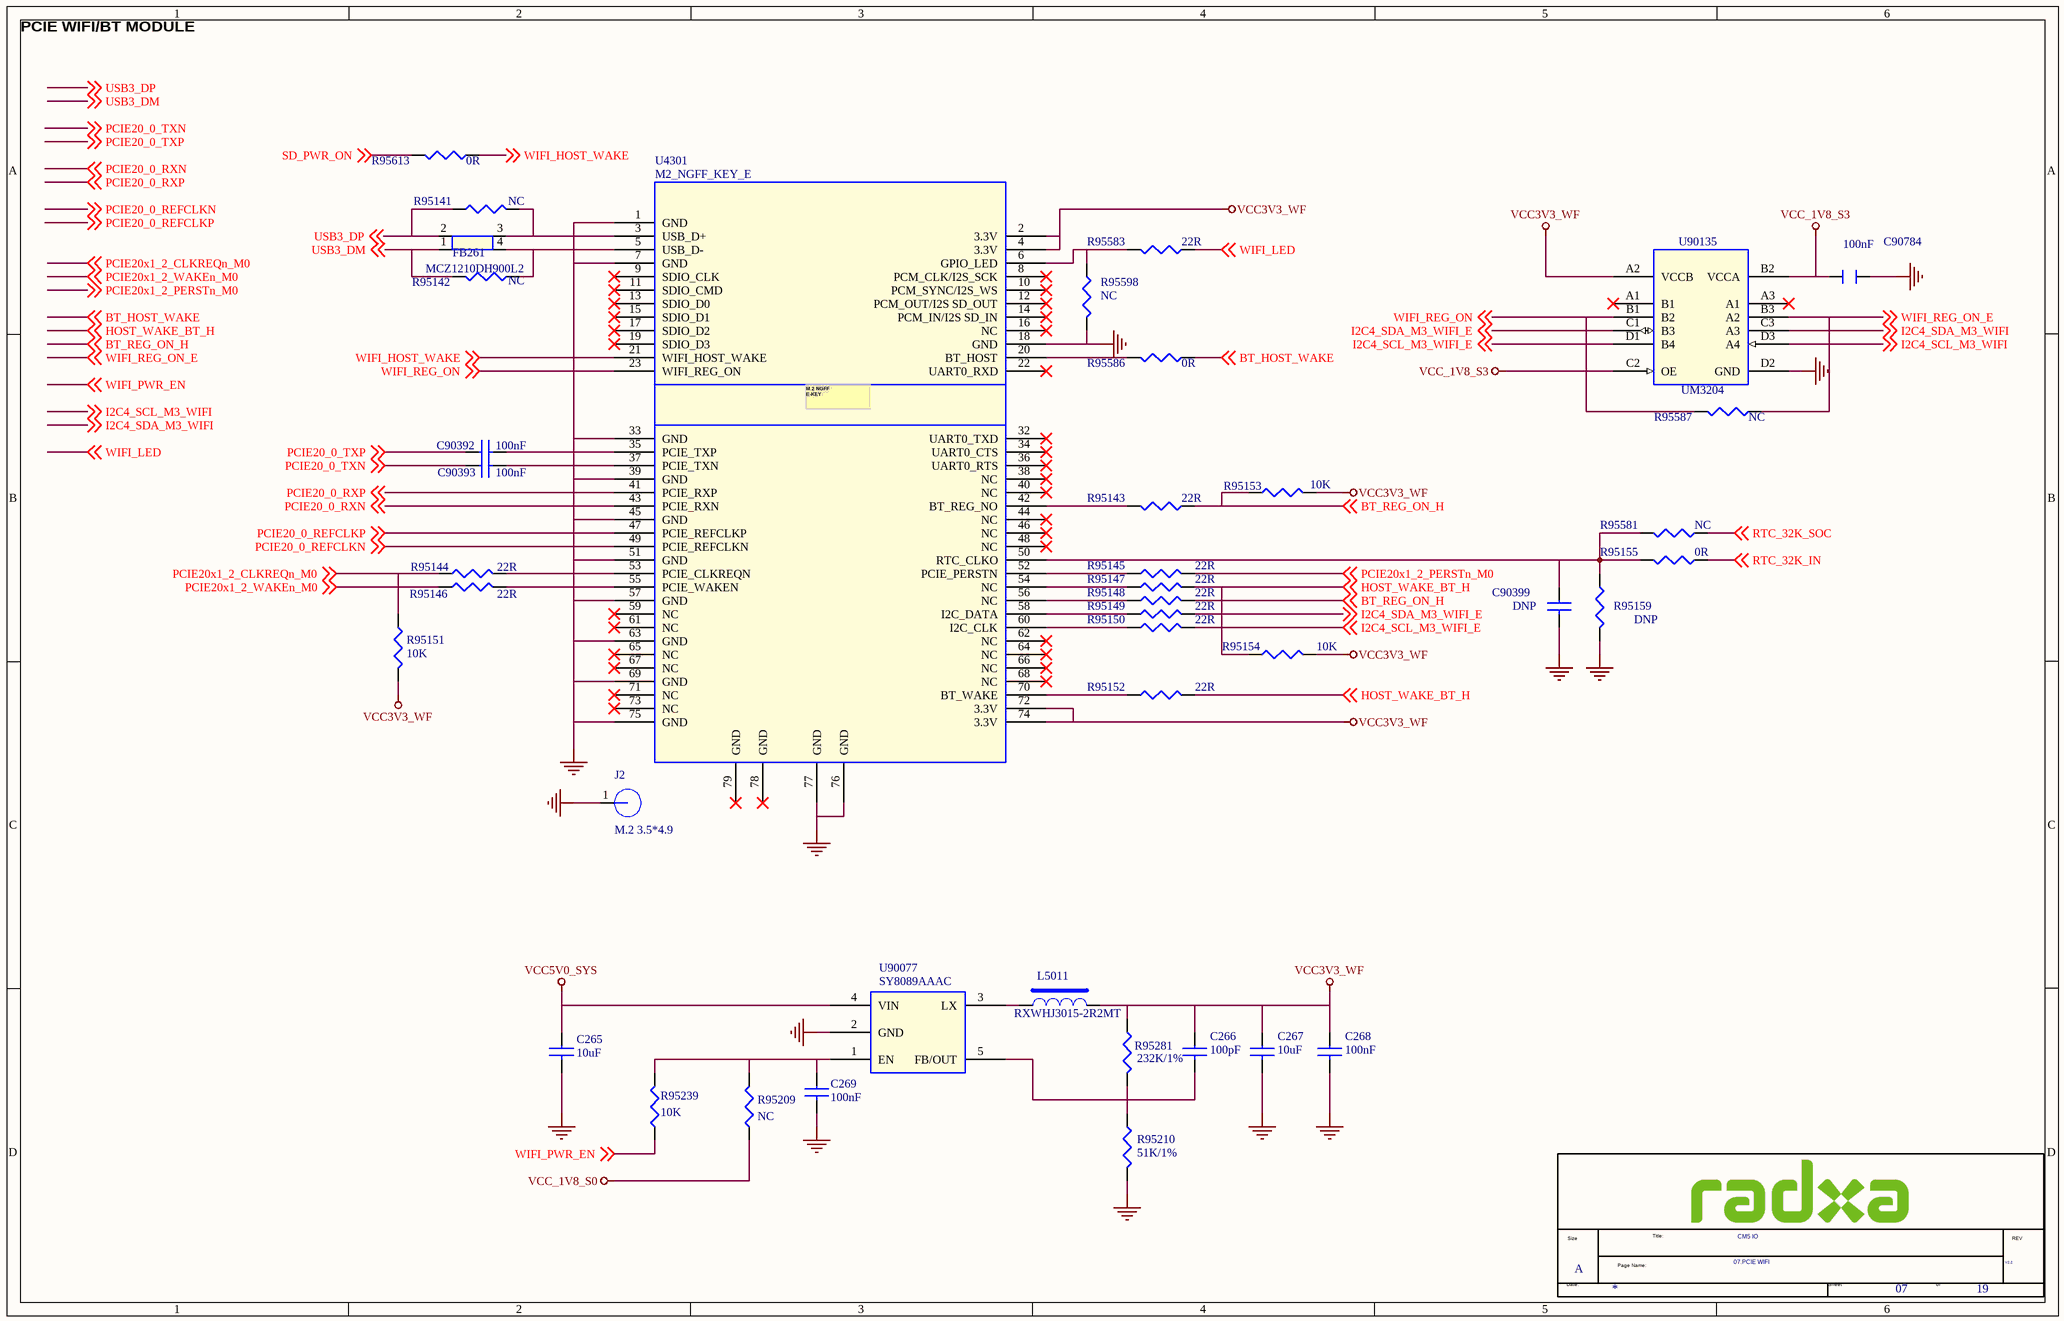
[diagram p6: 07_PCIE_WIFI.SchDoc]

### Parts
(Parts that share a designator on the sheet are numbered #1, #2 ... from top to bottom, then left to right.)
*#7  Doc: 07.PCIE WIFI  RevCode: V2.2  Title: CM5 IO  Page Size: A  Page Number: 07  Page Count: 19  (hidden comment: radxa_1010)  (graphical)
C265  10uF  [C0603]
C266  100pF  [C0201]
C267  10uF  [C0603]
C268  100nF  [C0201]
C269  100nF  [C0201]
C90392  100nF  [C0201]
C90393  100nF  [C0201]
C90399  DNP  [C0402]
C90784  100nF  [C0402]
FB261  MCZ1210DH900L2  [MCZ1210AH900L2]
J2  M.2 3.5*4.9  [H3.8MM]
L5011  RXWHJ3015-2R2MT  [IND_303015]
R95141  NC  [R0402]
R95142  NC  [R0402]
R95143  22R  [R0402]
R95144  22R  [R0402]
R95145  22R  [R0402]
R95146  22R  [R0402]
R95147  22R  [R0402]
R95148  22R  [R0402]
R95149  22R  [R0402]
R95150  22R  [R0402]
R95151  10K  [R0402]
R95152  22R  [R0402]
R95153  10K  [R0402]
R95154  10K  [R0402]
R95155  0R  [R0402]
R95159  DNP  [R0402]
R95209  NC  [R0402]
R95210  51K/1%  [R0402]
R95239  10K  [R0402]
R95281  232K/1%  [R0402]
R95581  NC  [R0402]
R95583  22R  [R0402]
R95586  0R  [R0402]
R95587  NC  [R0402]
R95598  NC  [R0402]
R95613  0R  [R0402]
U4301  M2_NGFF_KEY_E  [M2_NGFF_KEY_E_1]
U90077  SY8089AAAC  [SOT_23_5]
U90135  UM3204  [CSP-12]

### Nets
GND: C265.2 C267.2 C268.2 C269.2 C90399.2 C90784.1 J2.1 R95159.2 R95210.2 R95598.2 U4301.1(GND) U4301.7(GND) U4301.18(GND) U4301.33(GND) U4301.39(GND) U4301.45(GND) U4301.51(GND) U4301.57(GND) U4301.63(GND) U4301.69(GND) U4301.75(GND) U4301.76(GND) U4301.77(GND) U90077.2(GND) U90135.D2(GND)
VCC3V3_WF: C266.1 C267.1 C268.1 L5011.2 R95151.2 R95153.2 R95154.2 R95281.1 U4301.2(3.3V) U4301.4(3.3V) U4301.72(3.3V) U4301.74(3.3V) U90135.A2(VCCB)
VCC5V0_SYS: C265.1 U90077.4(VIN)
VCC_1V8_S0: R95209.1
VCC_1V8_S3: C90784.2 U90135.B2(VCCA) U90135.C2(OE)
BT_HOST_WAKE: R95586.1 ; off-sheet BT_HOST_WAKE
BT_REG_ON_H: R95143.1 R95148.1 R95153.1 ; off-sheet BT_REG_ON_H
HOST_WAKE_BT_H: R95147.1 R95152.1 R95154.1 ; off-sheet HOST_WAKE_BT_H
I2C4_SCL_M3_WIFI: U90135.D3(A4) ; off-sheet I2C4_SCL_M3_WIFI
I2C4_SCL_M3_WIFI_E: R95150.1 U90135.D1(B4) ; off-sheet I2C4_SCL_M3_WIFI_E
I2C4_SDA_M3_WIFI: U90135.C3(A3) ; off-sheet I2C4_SDA_M3_WIFI
I2C4_SDA_M3_WIFI_E: R95149.1 U90135.C1(B3) ; off-sheet I2C4_SDA_M3_WIFI_E
PCIE20_0_REFCLKN: U4301.49(PCIE_REFCLKN) ; off-sheet PCIE20_0_REFCLKN
PCIE20_0_REFCLKP: U4301.47(PCIE_REFCLKP) ; off-sheet PCIE20_0_REFCLKP
PCIE20_0_RXN: U4301.43(PCIE_RXN) ; off-sheet PCIE20_0_RXN
PCIE20_0_RXP: U4301.41(PCIE_RXP) ; off-sheet PCIE20_0_RXP
PCIE20_0_TXN: C90393.1 ; off-sheet PCIE20_0_TXN
PCIE20_0_TXP: C90392.1 ; off-sheet PCIE20_0_TXP
PCIE20x1_2_CLKREQn_M0: R95144.1 R95151.1 ; off-sheet PCIE20x1_2_CLKREQn_M0
PCIE20x1_2_PERSTn_M0: R95145.1 ; off-sheet PCIE20x1_2_PERSTn_M0
PCIE20x1_2_WAKEn_M0: R95146.1 ; off-sheet PCIE20x1_2_WAKEn_M0
RTC_32K_IN: R95155.1 ; off-sheet RTC_32K_IN
RTC_32K_SOC: R95581.1 ; off-sheet RTC_32K_SOC
SD_PWR_ON: R95613.2 ; off-sheet SD_PWR_ON
USB3_DM: FB261.1 R95142.2 ; off-sheet USB3_DM
USB3_DP: FB261.2 R95141.2 ; off-sheet USB3_DP
WIFI_HOST_WAKE: R95613.1 U4301.21(WIFI_HOST_WAKE) ; off-sheet WIFI_HOST_WAKE
WIFI_LED: R95583.1 ; off-sheet WIFI_LED
WIFI_PWR_EN: R95239.1 ; off-sheet WIFI_PWR_EN
WIFI_REG_ON: R95587.2 U4301.23(WIFI_REG_ON) U90135.B1(B2) ; off-sheet WIFI_REG_ON
WIFI_REG_ON_E: R95587.1 U90135.B3(A2) ; off-sheet WIFI_REG_ON_E
NetC266_2: C266.2 R95210.1 R95281.2 U90077.5(FB/OUT)
NetC269_1: C269.1 R95209.2 R95239.2 U90077.1(EN)
NetC90392_2: C90392.2 U4301.35(PCIE_TXP)
NetC90393_2: C90393.2 U4301.37(PCIE_TXN)
NetC90399_1: C90399.1 R95155.2 R95159.1 R95581.2 U4301.50(RTC_CLKO)
NetFB261_3: FB261.3 R95141.1 U4301.3(USB_D+)
NetFB261_4: FB261.4 R95142.1 U4301.5(USB_D-)
NetL5011_1: L5011.1 U90077.3(LX)
NetR95143_2: R95143.2 U4301.42(BT_REG_NO)
NetR95144_2: R95144.2 U4301.53(PCIE_CLKREQN)
NetR95145_2: R95145.2 U4301.52(PCIE_PERSTN)
NetR95146_2: R95146.2 U4301.55(PCIE_WAKEN)
NetR95147_2: R95147.2 U4301.54(NC)
NetR95148_2: R95148.2 U4301.56(NC)
NetR95149_2: R95149.2 U4301.58(I2C_DATA)
NetR95150_2: R95150.2 U4301.60(I2C_CLK)
NetR95152_2: R95152.2 U4301.70(BT_WAKE)
NetR95583_2: R95583.2 R95598.1 U4301.6(GPIO_LED)
NetR95586_2: R95586.2 U4301.20(BT_HOST)

Not connected (* = marked no-connect by the designer): U4301 8(PCM_CLK/I2S_SCK)* 9(SDIO_CLK)* 10(PCM_SYNC/I2S_WS)* 11(SDIO_CMD)* 12(PCM_OUT/I2S_SD_OUT)* 13(SDIO_D0)* 14(PCM_IN/I2S_SD_IN)* 15(SDIO_D1)* 16(NC)* 17(SDIO_D2)* 19(SDIO_D3)* 22(UART0_RXD)* 32(UART0_TXD)* 34(UART0_CTS)* 36(UART0_RTS)* 38(NC)* 40(NC)* 44(NC)* 46(NC)* 48(NC)* 59(NC)* 61(NC)* 62(NC)* 64(NC)* 65(NC)* 66(NC)* 67(NC)* 68(NC)* 71(NC)* 73(NC)* 78(GND)* 79(GND)*; U90135 A1(B1)* A3(A1)*

### Notes on the sheet
- PCIE WIFI/BT MODULE
- (in symbol M_8.2 NGFF EKEY SOCKET) M.2 NGFF / E-KEY
- (in symbol radxa_1010) Size; Title:; REV; Page Name:; Date:; Sheet; of

### Library data of the parts
C265 C267 = CAP NP_0_Dup5: cap,10.00uF,+/-10%,10V,X5R,C0805; Manufacturer: TDK; Voltage: 6.3V; RK PN: C2012X5R1A106K125AB; Priority: A; Tolerance: 10%; PCB Footprint: C0603; Dielectric: X5R; Part Type: C0805; Manufacturer PN: C2012X5R1A106K125AB; Created by: JJJ
C266 = CAP NP_0_Dup5: cap,100.00pF,+/-5%,50V,C0G,C0402; Manufacturer: TDK; Voltage: 25V; RK PN: C1005C0G1H101J050BA; Priority: A; Tolerance: 5%; PCB Footprint: C0201; Dielectric: C0G; Part Type: C0402; Manufacturer PN: C1005C0G1H101J050BA; Created by: JJJ
C268 = CAP NP_0_Dup5: cap,100.00nF,+/-10%,16V,X5R,C0402; Manufacturer: TDK; RK PN: C1005X5R1C104K050BA; Priority: A; Tolerance: 10%; Voltage: 16V; PCB Footprint: C0201; Dielectric: X5R; Part Type: C0402; Manufacturer PN: C1005X5R1C104K050BA; Created by: JJJ
C269 = CAP NP_0_Dup5: cap,100.00nF,+/-10%,16V,X5R,C0402; Manufacturer PN: C1005X5R1C104K050BA; Manufacturer: TDK; Tolerance: 10%; Priority: A; Voltage: 16V; PCB Footprint: C0201; Dielectric: X5R; Created by: JJJ; Part Type: C0402; RK PN: C1005X5R1C104K050BA
C90392 = CAP NP_0_Dup5: cap,100.00nF,+/-10%,10V,X5R,C0201; Manufacturer: TDK; RK PN: C0603X5R1A104K030BC; Priority: A; Tolerance: 10%; Voltage: 10V; PCB Footprint: C0201; Dielectric: X5R; Part Type: C0201; Manufacturer PN: C0603X5R1A104K030BC; Created by: JJJ
C90393 = CAP NP_0_Dup5: cap,100.00nF,+/-10%,10V,X5R,C0201; Manufacturer PN: C0603X5R1A104K030BC; Manufacturer: TDK; Tolerance: 10%; Priority: A; Voltage: 10V; PCB Footprint: C0201; Dielectric: X5R; Created by: JJJ; Part Type: C0201; RK PN: C0603X5R1A104K030BC
C90399 = CAP NP_0_Dup5: Did Not Place.; Manufacturer PN: DNPC0402; Priority: A; PCB Footprint: C0402; Created by: JJJ; Part Type: DNP; RK PN: DNPC0402; Option: DNP
C90784 = CAPACITOR_0: PAGE: 1; PCB Footprint: C0402
FB261 = MCZ1210AH900L2_1_Dup1: PCB Footprint: MCZ1210AH900L2
J2 = HOLE: 直径3.5mm hole; PCB Footprint: HOLE_D5_3D; RK PN: HOLE_3R50; Priority: A; Part Type: HOLE; Created by: CZD
L5011 = INDUCTORS OF FERRITE_Dup1: Power Inductor,2.2uH,0.3,IND_303015; Manufacturer PN: SWPA3015S2R2NT; Manufacturer: sunlord; DC Resistor: 0.06ohm; Isat: 1.6A; Resonace frequency: 86M; Tolerance: 30%; Priority: A; PCB Footprint: IND_303015; Created by: YTL; Irms: 1.6A; Part Type: POWER_IND; RK PN: SWPA3015S2R2NT
R95141 = RESISTOR_0_Dup2: 通用厚膜电阻,33R,+/-5%,R0402,1/16W.; Manufacturer: YAGEO; PCB Footprint: R0201; Tolerance: 5%; RK PN: RC0402JR-0733RL; Priority: A; Wattage: 1/16W; Part Type: 通用厚膜电阻; Manufacturer PN: RC0402JR-0733RL; Created by: YTL
R95142 = RESISTOR_0_Dup2: 通用厚膜电阻,33R,+/-5%,R0402,1/16W.; Manufacturer PN: RC0402JR-0733RL; Manufacturer: YAGEO; PCB Footprint: R0201; Tolerance: 5%; Wattage: 1/16W; Priority: A; Created by: YTL; Part Type: 通用厚膜电阻; RK PN: RC0402JR-0733RL
R95143 R95147 R95150 R95586 R95598 = RESISTOR_0_Dup2: 通用厚膜电阻,22R,+/-5%,R0402,1/16W.; Manufacturer: YAGEO; PCB Footprint: R0201; Tolerance: 5%; RK PN: RC0402JR-0722RL; Priority: A; Wattage: 1/16W; Part Type: 通用厚膜电阻; Manufacturer PN: RC0402JR-0722RL; Created by: YTL
R95144 R95146 = RESISTOR_0_Dup2: 通用厚膜电阻,22R,+/-5%,R0402,1/16W.; Manufacturer: YAGEO; Tolerance: 5%; RK PN: RC0402JR-0722RL; Priority: A; Wattage: 1/16W; PCB Footprint: R0402; Part Type: 通用厚膜电阻; Manufacturer PN: RC0402JR-0722RL; Created by: YTL
R95145 R95613 = RESISTOR_0_Dup2: 通用厚膜电阻,22R,+/-5%,R0402,1/16W.; Manufacturer PN: RC0402JR-0722RL; Manufacturer: YAGEO; Tolerance: 5%; Wattage: 1/16W; Priority: A; PCB Footprint: R0402; Created by: YTL; Part Type: 通用厚膜电阻; RK PN: RC0402JR-0722RL
R95148 R95149 R95152 R95583 R95587 = RESISTOR_0_Dup2: 通用厚膜电阻,22R,+/-5%,R0402,1/16W.; Manufacturer PN: RC0402JR-0722RL; Manufacturer: YAGEO; PCB Footprint: R0201; Tolerance: 5%; Wattage: 1/16W; Priority: A; Created by: YTL; Part Type: 通用厚膜电阻; RK PN: RC0402JR-0722RL
R95151 R95209 R95239 = RESISTOR_0_Dup2: 通用厚膜电阻,10K,+/-5%,R0402,1/16W.; Manufacturer: YAGEO; PCB Footprint: R0201; Tolerance: 5%; RK PN: RC0402JR-0710KL; Priority: A; Wattage: 1/16W; Part Type: 通用厚膜电阻; Manufacturer PN: RC0402JR-0710KL; Created by: YTL
R95153 R95154 = RESISTOR_0_Dup2: 通用厚膜电阻,10K,+/-5%,R0402,1/16W.; Manufacturer PN: RC0402JR-0710KL; Manufacturer: YAGEO; PCB Footprint: R0201; Tolerance: 5%; Option: DNP; Wattage: 1/16W; Priority: A; Created by: YTL; Part Type: 通用厚膜电阻; RK PN: RC0402JR-0710KL
R95155 = RESISTOR_0_Dup2: as R90334 on sheet 06_MicroSD_Card; PCB Footprint: R0402; Created by: YTL; Part Type: 通用厚膜电阻; RK PN: RC0402JR-070RL
R95159 = RESISTOR_0_Dup2: Did Not Place.; RK PN: DNPR0402; Priority: A; PCB Footprint: R0402; Part Type: DNP; Manufacturer PN: DNPR0402; Created by: JJJ
R95210 = RESISTOR_0_Dup2: 通用厚膜电阻,47K,+/-1%,R0402,1/16W.; Manufacturer: YAGEO; PCB Footprint: R0201; Tolerance: 1%; RK PN: RC0402FR-0747KL; Priority: A; Wattage: 1/16W; Part Type: 通用厚膜电阻; Manufacturer PN: RC0402FR-0747KL; Created by: YTL
R95281 = RESISTOR_0_Dup2: 通用厚膜电阻,200K,+/-1%,R0402,1/16W.; Manufacturer PN: RC0402FR-07200KL; Manufacturer: YAGEO; PCB Footprint: R0201; Tolerance: 1%; Wattage: 1/16W; Priority: A; Created by: YTL; Part Type: 通用厚膜电阻; RK PN: RC0402FR-07200KL
R95581 = RESISTOR_0_Dup2: 通用厚膜电阻,0R,+/-5%,R0402,1/16W.; Manufacturer: YAGEO; Tolerance: 5%; RK PN: RC0402JR-070RL; Priority: A; Wattage: 1/16W; PCB Footprint: R0402; Part Type: 通用厚膜电阻; Manufacturer PN: RC0402JR-070RL; Created by: YTL
U4301 = M_8.2 NGFF EKEY SOCKET: PCB Footprint: M2_NGFF_KEY_E_1
U90077 = DCDC_SY8088: High Efficiency 5.5V, 2A continuous, 3A peak, 1MHz Synchronous Step Down Regulator; Manufacturer PN: SY8089AAC; Manufacturer: Silergy（矽力杰）; Priority: A; Option: /CE8514B-2A; PCB Footprint: SOT_23_5; Created by: JJJ; Part Type: DCDC; RK PN: SY8089AAC
U90135 = MP2610_0: 4-bit Bi-directional Level Shifter  UM3204H; Part Number: PI4ULS5V104GAEX; Vendor: PERICOM; PCB Footprint: CSP-12
*#7 = radxa_1010: Page Create Date: March  8, 1995; Page Modify Date: *

## Sheet 08_AUDIO.SchDoc
size 297 x 209 mm
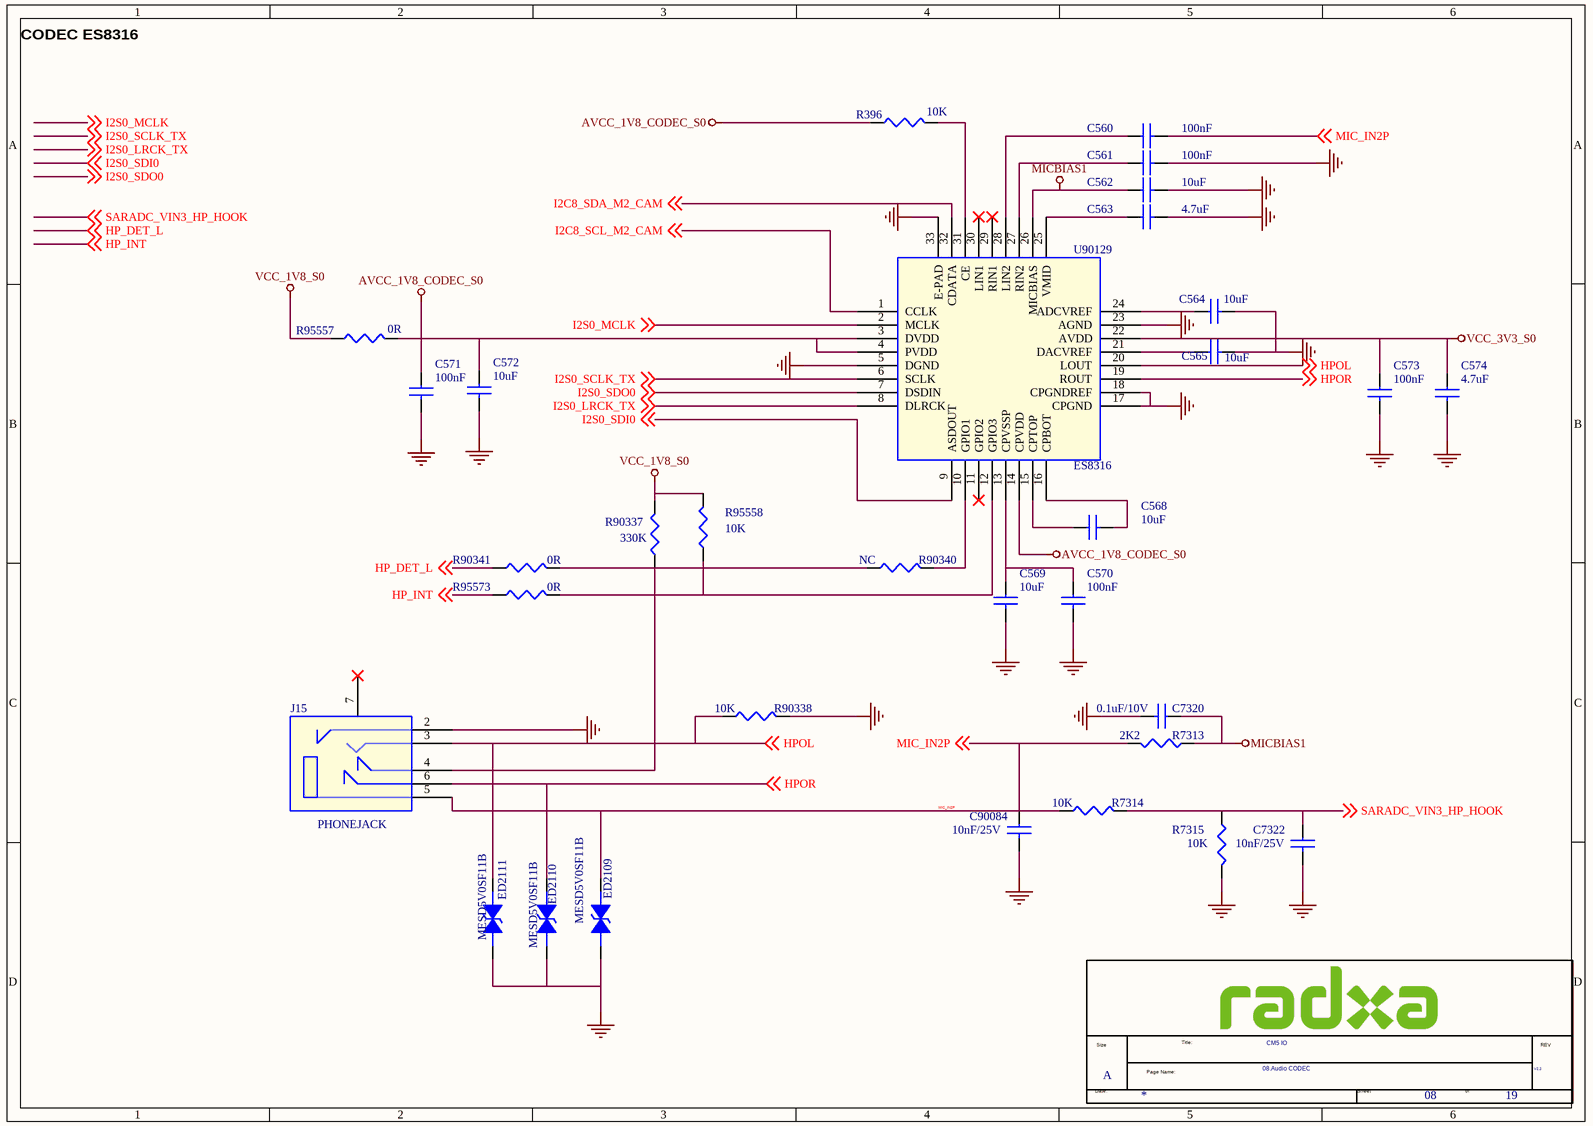
[diagram p7: 08_AUDIO.SchDoc]

### Parts
(Parts that share a designator on the sheet are numbered #1, #2 ... from top to bottom, then left to right.)
*#8  Doc: 08.Audio CODEC  RevCode: V2.2  Title: CM5 IO  Page Size: A  Page Number: 08  Page Count: 19  (hidden comment: radxa_1010)  (graphical)
C560  100nF  [C0402]
C561  100nF  [C0402]
C562  10uF  [C0603]
C563  4.7uF  [C0402]
C564  10uF  [C0603]
C565  10uF  [C0603]
C568  10uF  [C0603]
C569  10uF  [C0603]
C570  100nF  [C0402]
C571  100nF  [C0402]
C572  10uF  [C0603]
C573  100nF  [C0402]
C574  4.7uF  [C0402]
C7320  0.1uF/10V  [C0402]
C7322  10nF/25V  [C0402]
C90084  10nF/25V  [C0201]
ED2109  MESD5V0SF11B  [E0402N]
ED2110  MESD5V0SF11B  [E0402N]
ED2111  MESD5V0SF11B  [E0402N]
J15  PHONEJACK  [PJ-327A]
R396  10K  [R0402]
R7313  2K2  [R0402]
R7314  10K  [R0402]
R7315  10K  [R0402]
R90337  330K  [R0201]
R90338  10K  [R0201]
R90340  NC  [R0201]
R90341  0R  [R0201]
R95557  0R  [R0402]
R95558  10K  [R0201]
R95573  0R  [R0201]
U90129  ES8316  [QFN32P4X4]

### Nets
AVCC_1V8_CODEC_S0: C571.1 C572.1 R396.1 R95557.2 U90129.3(DVDD) U90129.4(PVDD) U90129.14(CPVDD)
GND: C561.2 C562.2 C563.2 C564.2 C565.2 C569.2 C570.2 C571.2 C572.2 C573.2 C574.2 C7320.2 C7322.2 C90084.2 ED2109.2 ED2110.2 ED2111.2 J15.2(DH) R7315.1 R90338.1 U90129.5(DGND) U90129.17(CPGND) U90129.18(CPGNDREF) U90129.23(AGND) U90129.33(E-PAD)
MICBIAS1: C562.1 C7320.1 R7313.2 U90129.26(MICBIAS)
VCC_1V8_S0: R90337.1 R95557.1 R95558.1
VCC_3V3_S0: C573.1 C574.1 U90129.22(AVDD)
HP_DET_L: R90341.2 ; off-sheet HP_DET_L
HP_INT: R95573.2 ; off-sheet HP_INT
HPOL: ED2111.1 J15.3(R) R90338.2 U90129.20(LOUT) ; off-sheet HPOL
HPOR: ED2110.1 J15.6(HP) U90129.19(ROUT) ; off-sheet HPOR
I2C8_SCL_M2_CAM: U90129.1(CCLK) ; off-sheet I2C8_SCL_M2_CAM
I2C8_SDA_M2_CAM: U90129.32(CDATA) ; off-sheet I2C8_SDA_M2_CAM
I2S0_LRCK_TX: U90129.8(DLRCK) ; off-sheet I2S0_LRCK_TX
I2S0_MCLK: U90129.2(MCLK) ; off-sheet I2S0_MCLK
I2S0_SCLK_TX: U90129.6(SCLK) ; off-sheet I2S0_SCLK_TX
I2S0_SDI0: U90129.9(ASDOUT) ; off-sheet I2S0_SDI0
I2S0_SDO0: U90129.7(DSDIN) ; off-sheet I2S0_SDO0
MIC_IN2P: C560.2 C90084.1 ED2109.1 J15.5(D) R7313.1 R7314.2 ; off-sheet MIC_IN2P
SARADC_VIN3_HP_HOOK: C7322.1 R7314.1 R7315.2 ; off-sheet SARADC_VIN3_HP_HOOK
NetC560_1: C560.1 U90129.28(LIN2)
NetC561_1: C561.1 U90129.27(RIN2)
NetC563_1: C563.1 U90129.25(VMID)
NetC564_1: C564.1 U90129.24(ADCVREF)
NetC565_1: C565.1 U90129.21(DACVREF)
NetC568_1: C568.1 U90129.15(CPTOP)
NetC568_2: C568.2 U90129.16(CPBOT)
NetC569_1: C569.1 C570.1 U90129.13(CPVSSP)
NetJ15_4: J15.4(L) R90337.2 R90340.2 R90341.1
NetR396_2: R396.2 U90129.31(CE)
NetR90340_1: R90340.1 U90129.10(GPIO1)
NetR95558_2: R95558.2 R95573.1 U90129.12(GPIO3)

Not connected (* = marked no-connect by the designer): J15 7(NC2)*; U90129 11(GPIO2)* 29(RIN1)* 30(LIN1)*

### Notes on the sheet
- CODEC ES8316
- (in symbol radxa_1010) Size; Title:; REV; Page Name:; Date:; Sheet; of

### Library data of the parts
C560 C570 C571 C573 = CAP NP_0_Dup2: cap,100.00nF,+/-10%,16V,X5R,C0402; Manufacturer PN: C1005X5R1C104K050BA; Manufacturer: TDK; Tolerance: 10%; Priority: A; Voltage: 16V; PCB Footprint: C0402; Dielectric: X5R; Created by: JJJ; Part Type: C0402; RK PN: C1005X5R1C104K050BA
C561 = CAP NP_0_Dup2: cap,100.00nF,+/-10%,16V,X5R,C0402; Manufacturer: TDK; RK PN: C1005X5R1C104K050BA; Priority: A; Tolerance: 10%; Voltage: 16V; PCB Footprint: C0402; Dielectric: X5R; Part Type: C0402; Manufacturer PN: C1005X5R1C104K050BA; Created by: JJJ
C562 C564 C565 C572 = CAP NP_0_Dup2: cap,10.00uF,+/-10%,10V,X5R,C0805; Manufacturer PN: C2012X5R1A106K125AB; Manufacturer: TDK; Tolerance: 10%; Priority: A; Voltage: 10V; PCB Footprint: C0603; Dielectric: X5R; Created by: JJJ; Part Type: C0805; RK PN: C2012X5R1A106K125AB
C563 = CAP NP_0_Dup2: cap,4.70uF,+/-10%,10V,X5R,C0603; Manufacturer PN: C1608X5R1A475K080AC; Manufacturer: TDK; Tolerance: 10%; Priority: A; Voltage: 10V; PCB Footprint: C0402; Dielectric: X5R; Created by: JJJ; Part Type: C0603; RK PN: C1608X5R1A475K080AC
C568 C569 = CAP NP_0_Dup2: cap,10.00uF,+/-10%,10V,X5R,C0805; Manufacturer: TDK; RK PN: C2012X5R1A106K125AB; Priority: A; Tolerance: 10%; Voltage: 10V; PCB Footprint: C0603; Dielectric: X5R; Part Type: C0805; Manufacturer PN: C2012X5R1A106K125AB; Created by: JJJ
C574 = CAP NP_0_Dup2: cap,4.70uF,+/-10%,10V,X5R,C0603; Manufacturer: TDK; RK PN: C1608X5R1A475K080AC; Priority: A; Tolerance: 10%; Voltage: 10V; PCB Footprint: C0402; Dielectric: X5R; Part Type: C0603; Manufacturer PN: C1608X5R1A475K080AC; Created by: JJJ
C7320 = CAP: RoHS CHIP CAP 0.1uF +10/-10% X7R; PCB Footprint: C0402
C7322 C90084 = CAP: RoHS CHIP CAP 0.01uF +10/-10% X7R
  C7322: PCB Footprint: C0402
  C90084: PCB Footprint: C0201
ED2109 = TVS: ESD Component,5V,30P,SMD,0402; BOM_TYPE: 40; BOM_VALUE: 0; PCB Footprint: E0402N
ED2110 ED2111 = TVS: ESD Component,5V,30P,SMD,0402; BOM_VALUE: 0; BOM_TYPE: 40; PCB Footprint: E0402N
J15 = PHONEJACK STEREO SW_0: 耳插; BOM_VALUE: 0; BOM_TYPE: 60; PCB Footprint: PJ-327A
R396 = RESISTOR_1_Dup1: 通用厚膜电阻,33R,+/-5%,R0402,1/16W.; Manufacturer: YAGEO; Tolerance: 5%; RK PN: RC0402JR-0733RL; Priority: A; Wattage: 1/16W; PCB Footprint: R0402; Part Type: 通用厚膜电阻; Manufacturer PN: RC0402JR-0733RL; Created by: YTL
R7313 = RESISTOR: ROHS CHIP RES 2K2 1/16W 5%; PCB Footprint: R0402
R7314 R7315 R90337 R90338 R90340 R90341 R95558 R95573 = RESISTOR: ROHS CHIP RES 0R 1/16W 5%
  R7314 R7315: PCB Footprint: R0402
  R90337 R90338 R90340 R90341 R95558 R95573: PCB Footprint: R0201
R95557 = RESISTOR_1_Dup1: 通用厚膜电阻,33R,+/-5%,R0402,1/16W.; Manufacturer PN: RC0402JR-0733RL; Manufacturer: YAGEO; Tolerance: 5%; Wattage: 1/16W; Priority: A; PCB Footprint: R0402; Created by: YTL; Part Type: 通用厚膜电阻; RK PN: RC0402JR-0733RL
U90129 = CODEC_ES8316: Low Power Audio CODEC; Manufacturer: Everest（顺芯）; Priority: A; PCB Footprint: QFN32P4X4; RK PN: ES8316; Part Type: Codec; Manufacturer PN: ES8316; Created by: JJJ
*#8 = radxa_1010: Page Create Date: March  8, 1995; Page Modify Date: *

## Sheet 09_MIPI_LCD_TX1.SchDoc
size 297 x 209 mm
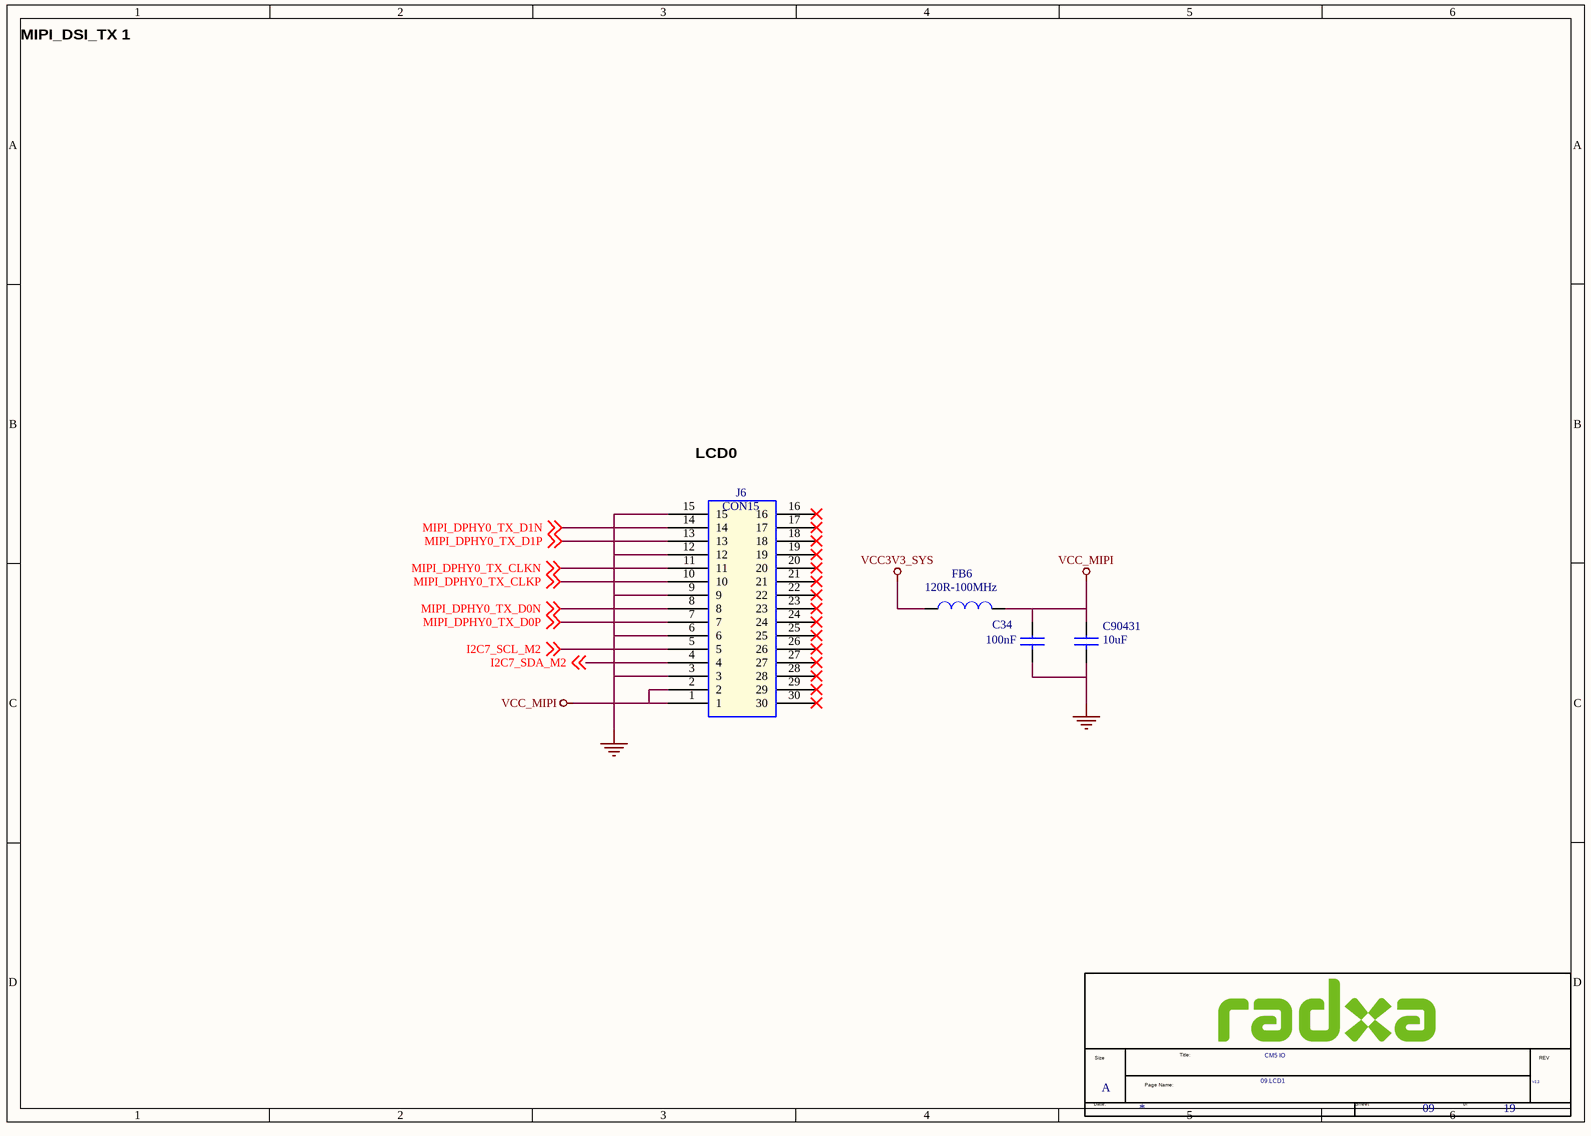
[diagram p8: 09_MIPI_LCD_TX1.SchDoc]

### Parts
(Parts that share a designator on the sheet are numbered #1, #2 ... from top to bottom, then left to right.)
*#9  Doc: 09.LCD1  RevCode: V2.2  Title: CM5 IO  Page Size: A  Page Number: 09  Page Count: 19  (hidden comment: radxa_1010)  (graphical)
C34  100nF  [C0402]
C90431  10uF  [C0603]
FB6  120R-100MHz  [L0402]
J6  CON15  [FPC15PIN-1.0MM-LS]

### Nets
GND: C34.2 C90431.2 J6.3 J6.6 J6.9 J6.12 J6.15
VCC3V3_SYS: FB6.1
VCC_MIPI: C34.1 C90431.1 FB6.2 J6.1 J6.2
I2C7_SCL_M2: J6.5 ; off-sheet I2C7_SCL_M2
I2C7_SDA_M2: J6.4 ; off-sheet I2C7_SDA_M2
MIPI_DPHY0_TX_CLKN: J6.11 ; off-sheet MIPI_DPHY0_TX_CLKN
MIPI_DPHY0_TX_CLKP: J6.10 ; off-sheet MIPI_DPHY0_TX_CLKP
MIPI_DPHY0_TX_D0N: J6.8 ; off-sheet MIPI_DPHY0_TX_D0N
MIPI_DPHY0_TX_D0P: J6.7 ; off-sheet MIPI_DPHY0_TX_D0P
MIPI_DPHY0_TX_D1N: J6.14 ; off-sheet MIPI_DPHY0_TX_D1N
MIPI_DPHY0_TX_D1P: J6.13 ; off-sheet MIPI_DPHY0_TX_D1P

Not connected (* = marked no-connect by the designer): J6 16* 17* 18* 19* 20* 21* 22* 23* 24* 25* 26* 27* 28* 29* 30*

### Notes on the sheet
- MIPI_DSI_TX 1
- (near J6) LCD0
- (in symbol radxa_1010) Size; Title:; REV; Page Name:; Date:; Sheet; of

### Library data of the parts
C34 = CAP NP_0_Dup4: cap,100.00nF,+/-10%,16V,X5R,C0402; Manufacturer PN: C1005X5R1C104K050BA; Manufacturer: TDK; Tolerance: 10%; Priority: A; Voltage: 16V; PCB Footprint: C0402; Dielectric: X5R; Created by: JJJ; Part Type: C0402; RK PN: C1005X5R1C104K050BA
C90431 = CAP NP_0_Dup3: cap,10.00uF,+/-10%,10V,X5R,C0805; Manufacturer PN: C2012X5R1A106K125AB; Manufacturer: TDK; Tolerance: 10%; Priority: A; Dielectric: X5R; PCB Footprint: C0603; Voltage: 10V; Created by: JJJ; Part Type: C0805; RK PN: C2012X5R1A106K125AB
FB6 = BEAD_0: BEAD,120R@100MHz,current=2000mA,0603; Manufacturer: Murata; Tolerance: 25%; Irms: 2A; DC Resistor: 0.030ohm; RK PN: BLM18KG121TN1; Priority: L; PCB Footprint: L0402; Part Type: BEAD; Manufacturer PN: BLM18KG121TN1; Created by: DZS
J6 = CON15_4: PCB Footprint: FPC15PIN-1.0MM-LS
*#9 = radxa_1010: Page Create Date: March  8, 1995; Page Modify Date: *

## Sheet 10_MIPI_LCD_TX2.SchDoc
size 297 x 209 mm
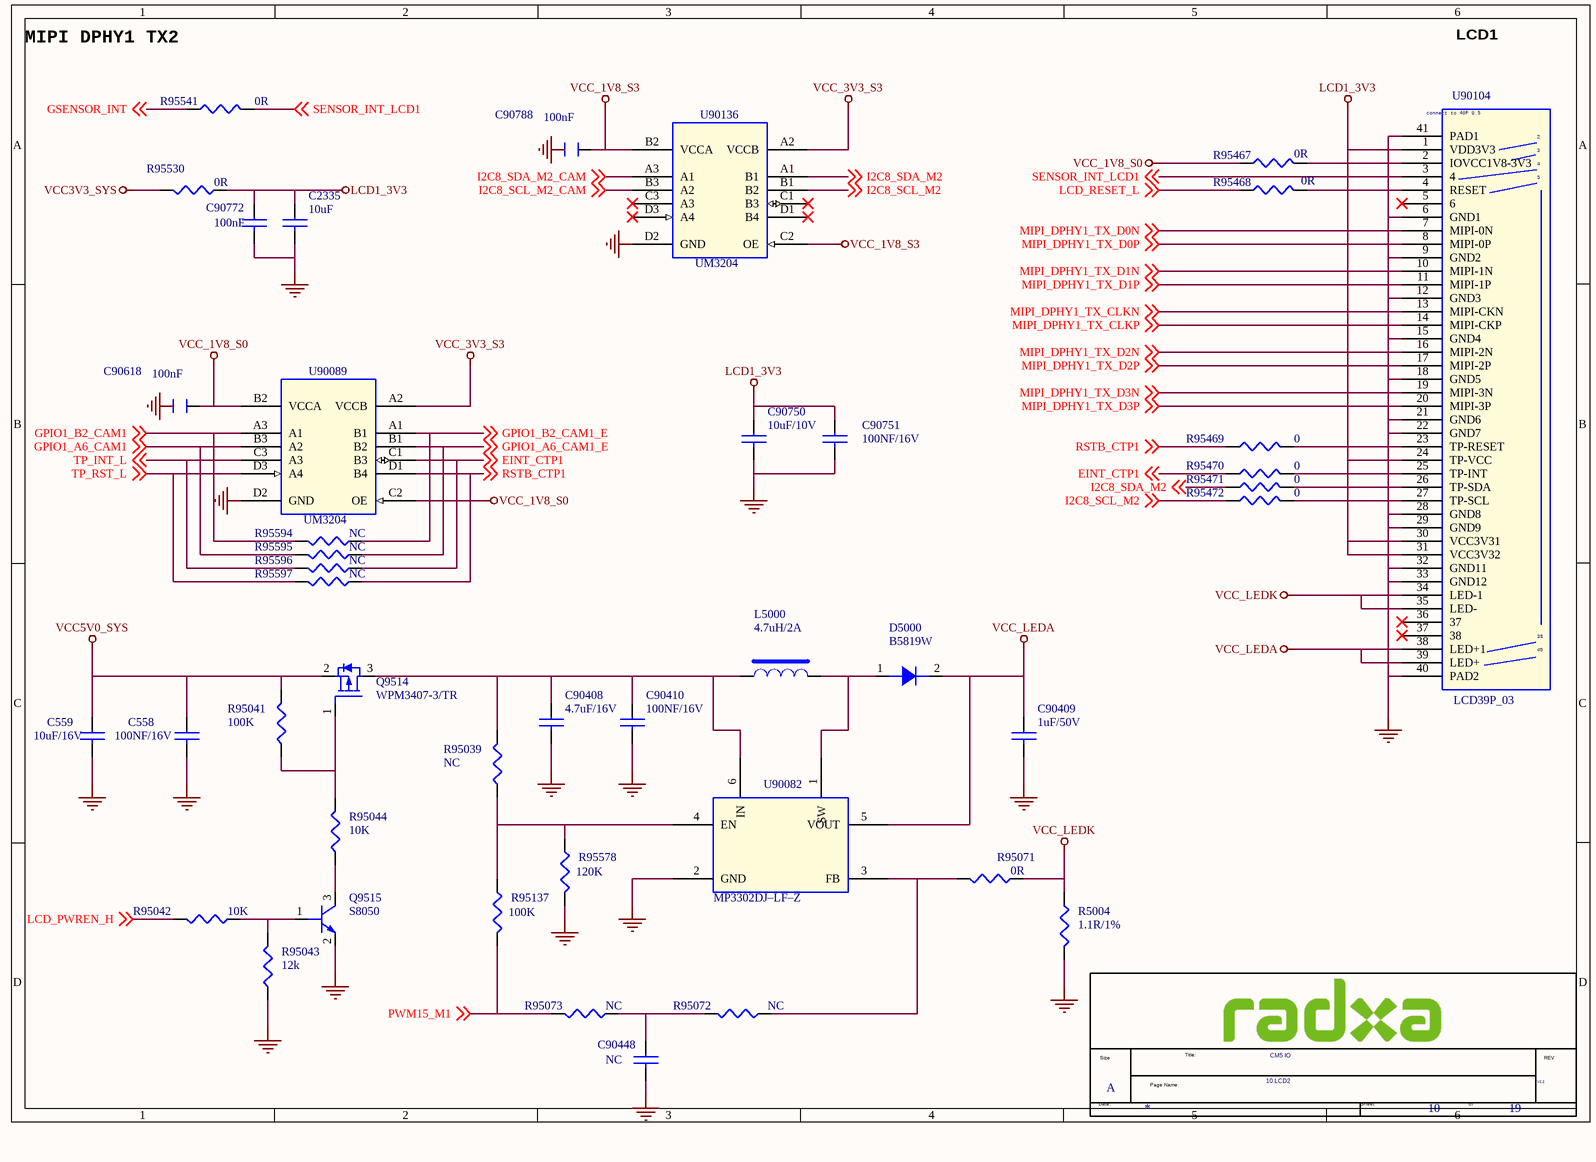
[diagram p9: 10_MIPI_LCD_TX2.SchDoc]

### Parts
(Parts that share a designator on the sheet are numbered #1, #2 ... from top to bottom, then left to right.)
*#10  Doc: 10.LCD2  RevCode: V2.2  Title: CM5 IO  Page Size: A  Page Number: 10  Page Count: 19  (hidden comment: radxa_1010)  (graphical)
C558  100NF/16V  [C0402]
C559  10uF/16V  [C0603]
C2335  10uF  [C0603]
C90408  4.7uF/16V  [C0603]
C90409  1uF/50V  [C0603]
C90410  100NF/16V  [C0402]
C90448  NC  [C0402]
C90618  100nF  [C0402]
C90750  10uF/10V  [C0603]
C90751  100NF/16V  [C0402]
C90772  100nF  [C0402]
C90788  100nF  [C0402]
D5000  B5819W  [SOD_123]
L5000  4.7uH/2A  [IND-303015]
Q9514  WPM3407-3/TR  [SOT23]
Q9515  S8050  [SOT_23]
R5004  1.1R/1%  [R0402]
R95039  NC  [R0402]
R95041  100K  [R0402]
R95042  10K  [R0402]
R95043  12k  [R0402]
R95044  10K  [R0402]
R95071  0R  [R0402]
R95072  NC  [R0402]
R95073  NC  [R0402]
R95137  100K  [R0402]
R95467  0R  [R0402]
R95468  0R  [R0402]
R95469  0  [R0201]
R95470  0  [R0201]
R95471  0  [R0201]
R95472  0  [R0201]
R95530  0R  [R0402]
R95541  0R  [R0402]
R95578  120K  [R0402]
R95594  NC  [R0402]
R95595  NC  [R0402]
R95596  NC  [R0402]
R95597  NC  [R0402]
U90082  MP3302DJ–LF–Z  [sot23-6]
U90089  UM3204  [CSP-12]
U90104  LCD39P_03  [LCD39PIN-ok]
U90136  UM3204  [CSP-12]

### Nets
GND: C558.2 C559.2 C2335.2 C90408.2 C90409.2 C90410.2 C90448.2 C90750.2 C90751.2 C90772.2 Q9515.2(EMITTER) R5004.2 R95043.2 R95578.1 U90082.2(GND) U90089.D2(GND) U90104.6(GND1) U90104.9(GND2) U90104.12(GND3) U90104.15(GND4) U90104.18(GND5) U90104.21(GND6) U90104.22(GND7) U90104.28(GND8) U90104.29(GND9) U90104.32(GND11) U90104.33(GND12) U90104.40(PAD2) U90104.41(PAD1) U90136.D2(GND)
LCD1_3V3: C2335.1 C90750.1 C90751.1 C90772.1 R95530.2 U90104.1(VDD3V3) U90104.24(TP-VCC) U90104.30(VCC3V31) U90104.31(VCC3V32)
VCC3V3_SYS: R95530.1
VCC5V0_SYS: C558.1 C559.1 Q9514.2(SOURCE) R95041.1
VCC_1V8_S0: C90618.2 R95467.1 U90089.B2(VCCA) U90089.C2(OE)
VCC_1V8_S3: C90788.2 U90136.B2(VCCA) U90136.C2(OE)
VCC_3V3_S3: U90089.A2(VCCB) U90136.A2(VCCB)
VCC_LEDA: C90409.1 D5000.2(K) U90082.5(VOUT) U90104.38(LED+1) U90104.39(LED+)
VCC_LEDK: R5004.1 R95071.2 U90104.34(LED-1) U90104.35(LED-)
EINT_CTP1: R95470.1 R95596.2 U90089.C1(B3) ; off-sheet EINT_CTP1
GPIO1_A6_CAM1: R95595.1 U90089.B3(A2) ; off-sheet GPIO1_A6_CAM1
GPIO1_A6_CAM1_E: R95595.2 U90089.B1(B2) ; off-sheet GPIO1_A6_CAM1_E
GPIO1_B2_CAM1: R95594.1 U90089.A3(A1) ; off-sheet GPIO1_B2_CAM1
GPIO1_B2_CAM1_E: R95594.2 U90089.A1(B1) ; off-sheet GPIO1_B2_CAM1_E
GSENSOR_INT: R95541.2 ; off-sheet GSENSOR_INT
I2C8_SCL_M2: R95472.1 U90136.B1(B2) ; off-sheet I2C8_SCL_M2
I2C8_SCL_M2_CAM: U90136.B3(A2) ; off-sheet I2C8_SCL_M2_CAM
I2C8_SDA_M2: R95471.1 U90136.A1(B1) ; off-sheet I2C8_SDA_M2
I2C8_SDA_M2_CAM: U90136.A3(A1) ; off-sheet I2C8_SDA_M2_CAM
LCD_PWREN_H: R95042.1 ; off-sheet LCD_PWREN_H
LCD_RESET_L: R95468.1 ; off-sheet LCD_RESET_L
MIPI_DPHY1_TX_CLKN: U90104.13(MIPI-CKN) ; off-sheet MIPI_DPHY1_TX_CLKN
MIPI_DPHY1_TX_CLKP: U90104.14(MIPI-CKP) ; off-sheet MIPI_DPHY1_TX_CLKP
MIPI_DPHY1_TX_D0N: U90104.7(MIPI-0N) ; off-sheet MIPI_DPHY1_TX_D0N
MIPI_DPHY1_TX_D0P: U90104.8(MIPI-0P) ; off-sheet MIPI_DPHY1_TX_D0P
MIPI_DPHY1_TX_D1N: U90104.10(MIPI-1N) ; off-sheet MIPI_DPHY1_TX_D1N
MIPI_DPHY1_TX_D1P: U90104.11(MIPI-1P) ; off-sheet MIPI_DPHY1_TX_D1P
MIPI_DPHY1_TX_D2N: U90104.16(MIPI-2N) ; off-sheet MIPI_DPHY1_TX_D2N
MIPI_DPHY1_TX_D2P: U90104.17(MIPI-2P) ; off-sheet MIPI_DPHY1_TX_D2P
MIPI_DPHY1_TX_D3N: U90104.19(MIPI-3N) ; off-sheet MIPI_DPHY1_TX_D3N
MIPI_DPHY1_TX_D3P: U90104.20(MIPI-3P) ; off-sheet MIPI_DPHY1_TX_D3P
PWM15_M1: R95073.1 R95137.1 ; off-sheet PWM15_M1
RSTB_CTP1: R95469.1 R95597.2 U90089.D1(B4) ; off-sheet RSTB_CTP1
SENSOR_INT_LCD1: R95541.1 U90104.3(4) ; off-sheet SENSOR_INT_LCD1
TP_INT_L: R95596.1 U90089.C3(A3) ; off-sheet TP_INT_L
TP_RST_L: R95597.1 U90089.D3(A4) ; off-sheet TP_RST_L
NetC90408_1: C90408.1 C90410.1 L5000.1 Q9514.3(DRAIN) R95039.1 U90082.6(IN)
NetC90448_1: C90448.1 R95072.1 R95073.2
NetD5000_1: D5000.1(A) L5000.2 U90082.1(SW)
NetQ9514_1: Q9514.1(GATE) R95041.2 R95044.1
NetQ9515_1: Q9515.1(BASE) R95042.2 R95043.1
NetQ9515_3: Q9515.3(COLLECTOR) R95044.2
NetR95039_2: R95039.2 R95137.2 R95578.2 U90082.4(EN)
NetR95071_1: R95071.1 R95072.2 U90082.3(FB)
NetR95467_2: R95467.2 U90104.2(IOVCC1V8-3V3)
NetR95468_2: R95468.2 U90104.4(RESET)
NetR95469_2: R95469.2 U90104.23(TP-RESET)
NetR95470_2: R95470.2 U90104.25(TP-INT)
NetR95471_2: R95471.2 U90104.26(TP-SDA)
NetR95472_2: R95472.2 U90104.27(TP-SCL)

Not connected (* = marked no-connect by the designer): C90618 1; C90788 1; U90104 5(6)* 36(37)* 37(38)*; U90136 C1(B3)* C3(A3)* D1(B4)* D3(A4)*

### Notes on the sheet
- MIPI DPHY1 TX2
- LCD1
- Labels drawn without touching a wire or pin: GND
- (in symbol LCD39P_03) connect to 40P 0.5
- (in symbol radxa_1010) Size; Title:; REV; Page Name:; Date:; Sheet; of

### Library data of the parts
C558 = CAP NP_0_Dup2: cap,100.00nF,+/-10%,16V,X5R,C0402; Manufacturer: TDK; Number: 37; RK PN: C1005X5R1C104K050BA; Priority: A; Tolerance: 10%; C_Voltage: 6.3V; Voltage: 16V; PCB Footprint: C0402; Dielectric: X5R; Part Type: C0402; Manufacturer PN: C1005X5R1C104K050BA; Created by: JJJ
C559 = CAP NP_0_Dup2: cap,10.00uF,+/-10%,10V,X5R,C0603; Manufacturer PN: C1608X5R1A106K080AC; Manufacturer: TDK; Tolerance: 10%; C_Voltage: 6.3V; Priority: A; Voltage: 10V; PCB Footprint: C0603; Dielectric: X5R; Created by: JJJ; Part Type: C0603; RK PN: C1608X5R1A106K080AC
C2335 C90750 = CAP NP_0_Dup2: cap,10.00uF,+/-10%,10V,X5R,C0603; Manufacturer: TDK; RK PN: C1608X5R1A106K080AC; Priority: A; C_Voltage: 6.3V; Tolerance: 10%; Voltage: 10V; PCB Footprint: C0603; Dielectric: X5R; Part Type: C0603; Manufacturer PN: C1608X5R1A106K080AC; Created by: JJJ
C90408 = CAP NP_0_Dup2: as C574 on sheet 08_AUDIO; Voltage: 10V; PCB Footprint: C0603; Dielectric: X5R; Part Type: C0603; Manufacturer PN: C1608X5R1A475K080AC; Created by: JJJ
C90409 = CAP NP_0_Dup2: cap,2.20uF,+/-10%,35V,X5R,C0603; Manufacturer: TDK; RK PN: C1608X5R1V225K080AC; Priority: A; Tolerance: 10%; Voltage: 35V; PCB Footprint: C0603; Dielectric: X5R; Part Type: C0603; Manufacturer PN: C1608X5R1V225K080AC; Created by: JJJ
C90410 C90448 C90772 = CAP NP_0_Dup2: as C561 on sheet 08_AUDIO; Voltage: 16V; PCB Footprint: C0402; Dielectric: X5R; Part Type: C0402; Manufacturer PN: C1005X5R1C104K050BA; Created by: JJJ
C90618 C90788 = CAPACITOR_0: PAGE: 1; PCB Footprint: C0402
C90751 = CAP NP_0_Dup2: cap,100.00nF,+/-10%,16V,X5R,C0402; Manufacturer PN: C1005X5R1C104K050BA; Manufacturer: TDK; C_Voltage: 6.3V; Tolerance: 10%; Priority: A; Number: 37; Voltage: 16V; PCB Footprint: C0402; Dielectric: X5R; Created by: JJJ; Part Type: C0402; RK PN: C1005X5R1C104K050BA
D5000 = DIODE_Dup1: Schottky Barrier，SS32 DO214AC; Manufacturer: 星海; RK PN: SS32; Priority: A; PCB Footprint: SOD_123; Part Type: Schottky rectifier; Manufacturer PN: SS32; Created by: JJJ
L5000 = INDUCTORS OF FERRITE_Dup1: Power Inductor,4.7uH,0.2,IND_404030; Manufacturer: sunlord; DC Resistor: 0.06ohm; Isat: 2.9A; RK PN: SWPA4030S4R7MT; Priority: A; Tolerance: 20%; Irms: 2A; Resonace frequency: 31M; PCB Footprint: IND-303015; Part Type: POWER_IND; Manufacturer PN: SWPA4030S4R7MT; Created by: YTL
Q9514 = MOSFET P: as Q1 on sheet 06_MicroSD_Card; PCB Footprint: SOT_23; Created by: JJJ; Manufacturer PN: WPM3407-3/TR; Part Type: PMOS; RK PN: WPM3407-3/TR
Q9515 = NPN: S8050,SOT23; Manufacturer: 长电; Manufacturer PN: S8050_SOT23; Priority: A; Ic: 0.5A; Vceo: 25V; Pc: 0.3W; PCB Footprint: SOT_23; RK PN: S8050; Part Type: NPN; Created by: JJJ
R5004 = RESISTOR_1_Dup1: 通用厚膜电阻,3R9,+/-5%,R1206,1/4W.; Manufacturer PN: RC1206JR-073R9L; Manufacturer: YAGEO; Tolerance: 5%; Wattage: 1/4W; Priority: A; PCB Footprint: R1206; Created by: YTL; Part Type: 通用厚膜电阻; RK PN: RC1206JR-073R9L
R95039 R95071 R95072 = RESISTOR_1_Dup1: 通用厚膜电阻,27K,+/-5%,R0402,1/16W.; Manufacturer PN: RC0402JR-0727KL; Manufacturer: YAGEO; PCB Footprint: R0201; Tolerance: 5%; OPTION: DNP; Wattage: 1/16W; Priority: A; Created by: YTL; Part Type: 通用厚膜电阻; RK PN: RC0402JR-0727KL
R95041 R95042 R95044 = RESISTOR_1_Dup1: 通用厚膜电阻,10K,+/-5%,R0402,1/16W.; Manufacturer PN: RC0402JR-0710KL; Manufacturer: YAGEO; PCB Footprint: R0201; Tolerance: 5%; Wattage: 1/16W; Priority: A; Created by: YTL; Part Type: 通用厚膜电阻; RK PN: RC0402JR-0710KL
R95043 = RESISTOR_1_Dup1: 通用厚膜电阻,20K,+/-5%,R0402,1/16W.; Manufacturer PN: RC0402JR-0720KL; Manufacturer: YAGEO; PCB Footprint: R0201; Tolerance: 5%; Wattage: 1/16W; Priority: A; Created by: YTL; Part Type: 通用厚膜电阻; RK PN: RC0402JR-0720KL
R95073 R95137 R95578 = RESISTOR_1_Dup1: 通用厚膜电阻,27K,+/-5%,R0402,1/16W.; Manufacturer: YAGEO; PCB Footprint: R0201; Tolerance: 5%; RK PN: RC0402JR-0727KL; Priority: A; Wattage: 1/16W; OPTION: DNP; Part Type: 通用厚膜电阻; Manufacturer PN: RC0402JR-0727KL; Created by: YTL
R95467 = RESISTOR_1_Dup1: 通用厚膜电阻,100K,+/-5%,R0402,1/16W.; Manufacturer: YAGEO; PCB Footprint: R0201; Tolerance: 5%; RK PN: RC0402JR-07100KL; Priority: A; Wattage: 1/16W; Part Type: 通用厚膜电阻; Manufacturer PN: RC0402JR-07100KL; Created by: YTL
R95468 = RESISTOR_1_Dup1: 通用厚膜电阻,100K,+/-5%,R0402,1/16W.; Manufacturer PN: RC0402JR-07100KL; Manufacturer: YAGEO; Tolerance: 5%; Wattage: 1/16W; Priority: A; PCB Footprint: R0402; Created by: YTL; Part Type: 通用厚膜电阻; RK PN: RC0402JR-07100KL
R95469-R95471 = R / 0 / ohm / 0201_0: FunctionGroup: BB; FS: Y; FPLIST: R0201,M0201; ebom: X / BB / DEBUG IF; Free_Sample: Y; PCB Footprint: R0201
R95472 = R / 0 / ohm / 0201_0: ebom: X / BB / DEBUG IF; Free_Sample: Y; FPLIST: R0201,M0201; FunctionGroup: BB; FS: Y; PCB Footprint: R0201
R95530 R95541 R95594-R95597 = RESISTOR_1_Dup1: 通用厚膜电阻,10K,+/-5%,R0402,1/16W.; Manufacturer PN: RC0402JR-0710KL; Manufacturer: YAGEO; Tolerance: 5%; Wattage: 1/16W; Priority: A; PCB Footprint: R0402; Created by: YTL; Part Type: 通用厚膜电阻; RK PN: RC0402JR-0710KL
U90082 = MP3302_0: PCB Footprint: sot23-6
U90089 U90136 = MP2610_0: as U90135 on sheet 07_PCIE_WIFI; PCB Footprint: CSP-12
*#10 = radxa_1010: Page Create Date: March  8, 1995; Page Modify Date: *
U90104 = LCD39P_03: PCB Footprint: LCD39PIN-ok